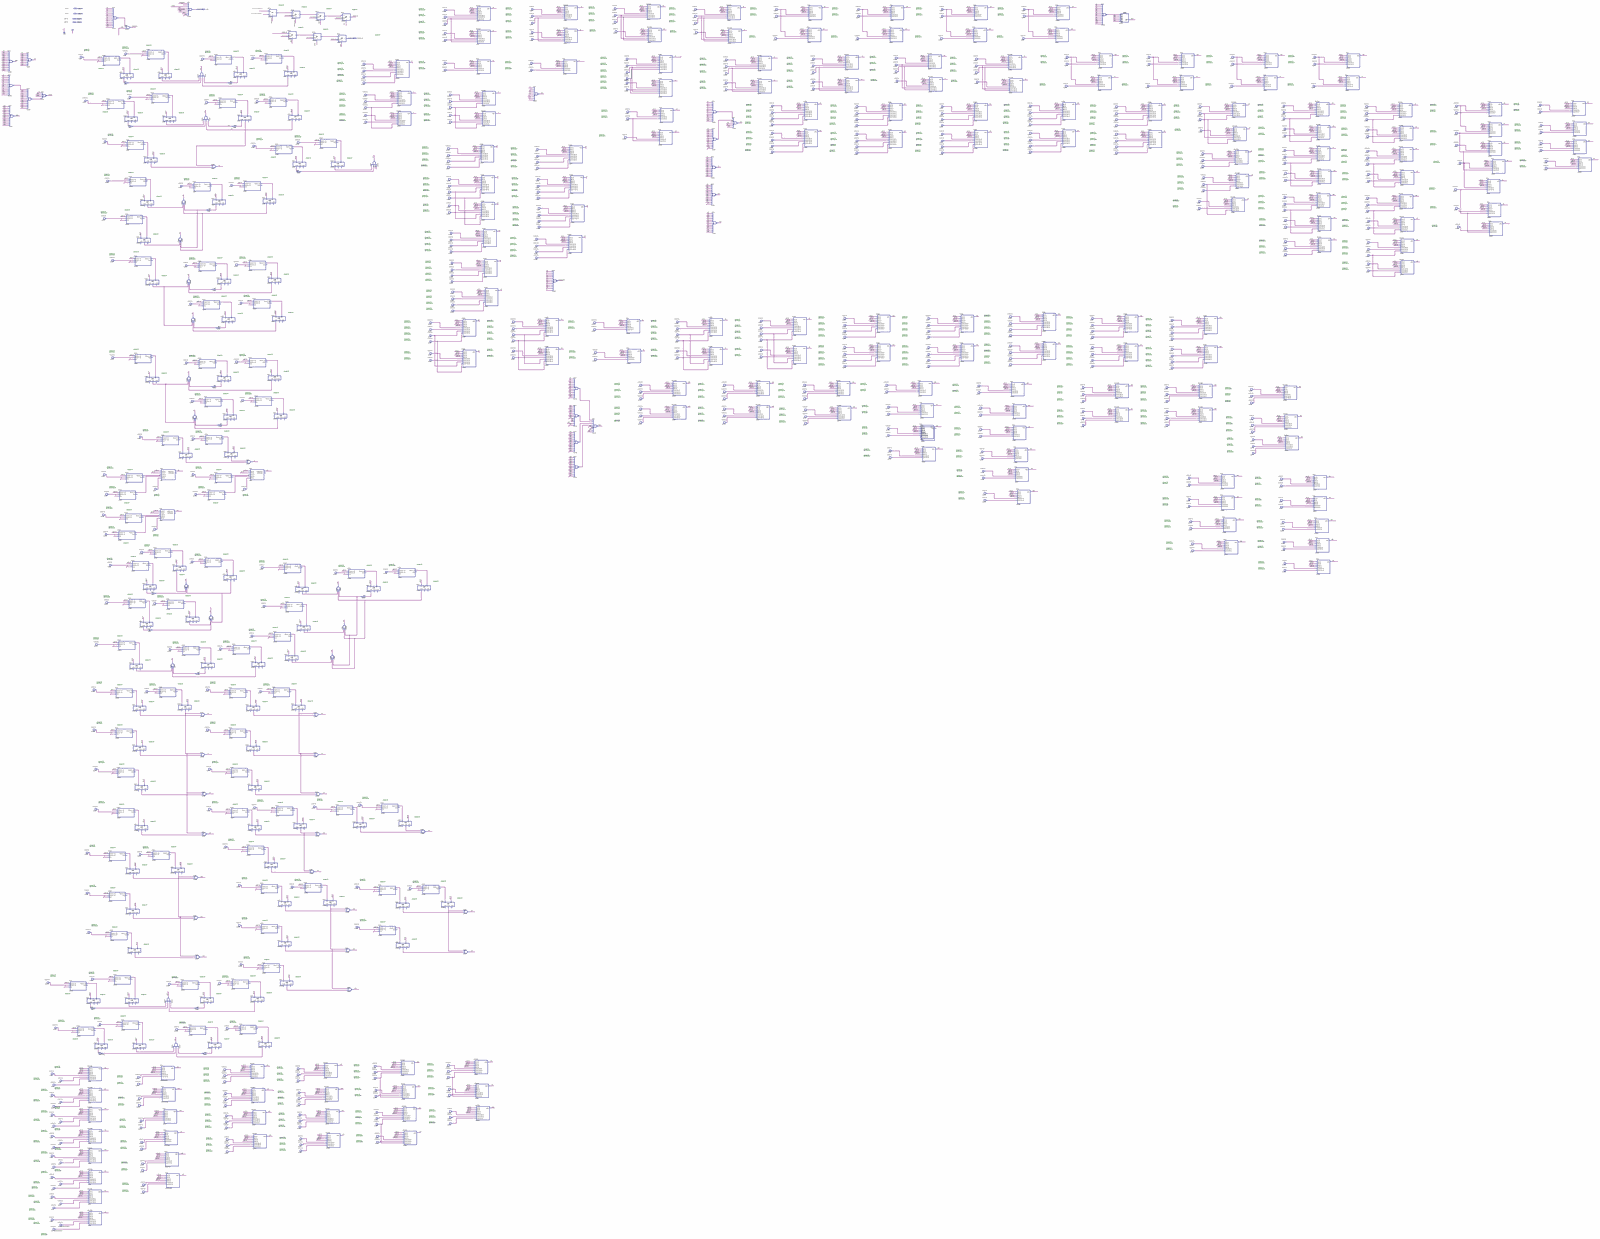
[diagram p0: schematic sheet, whole]
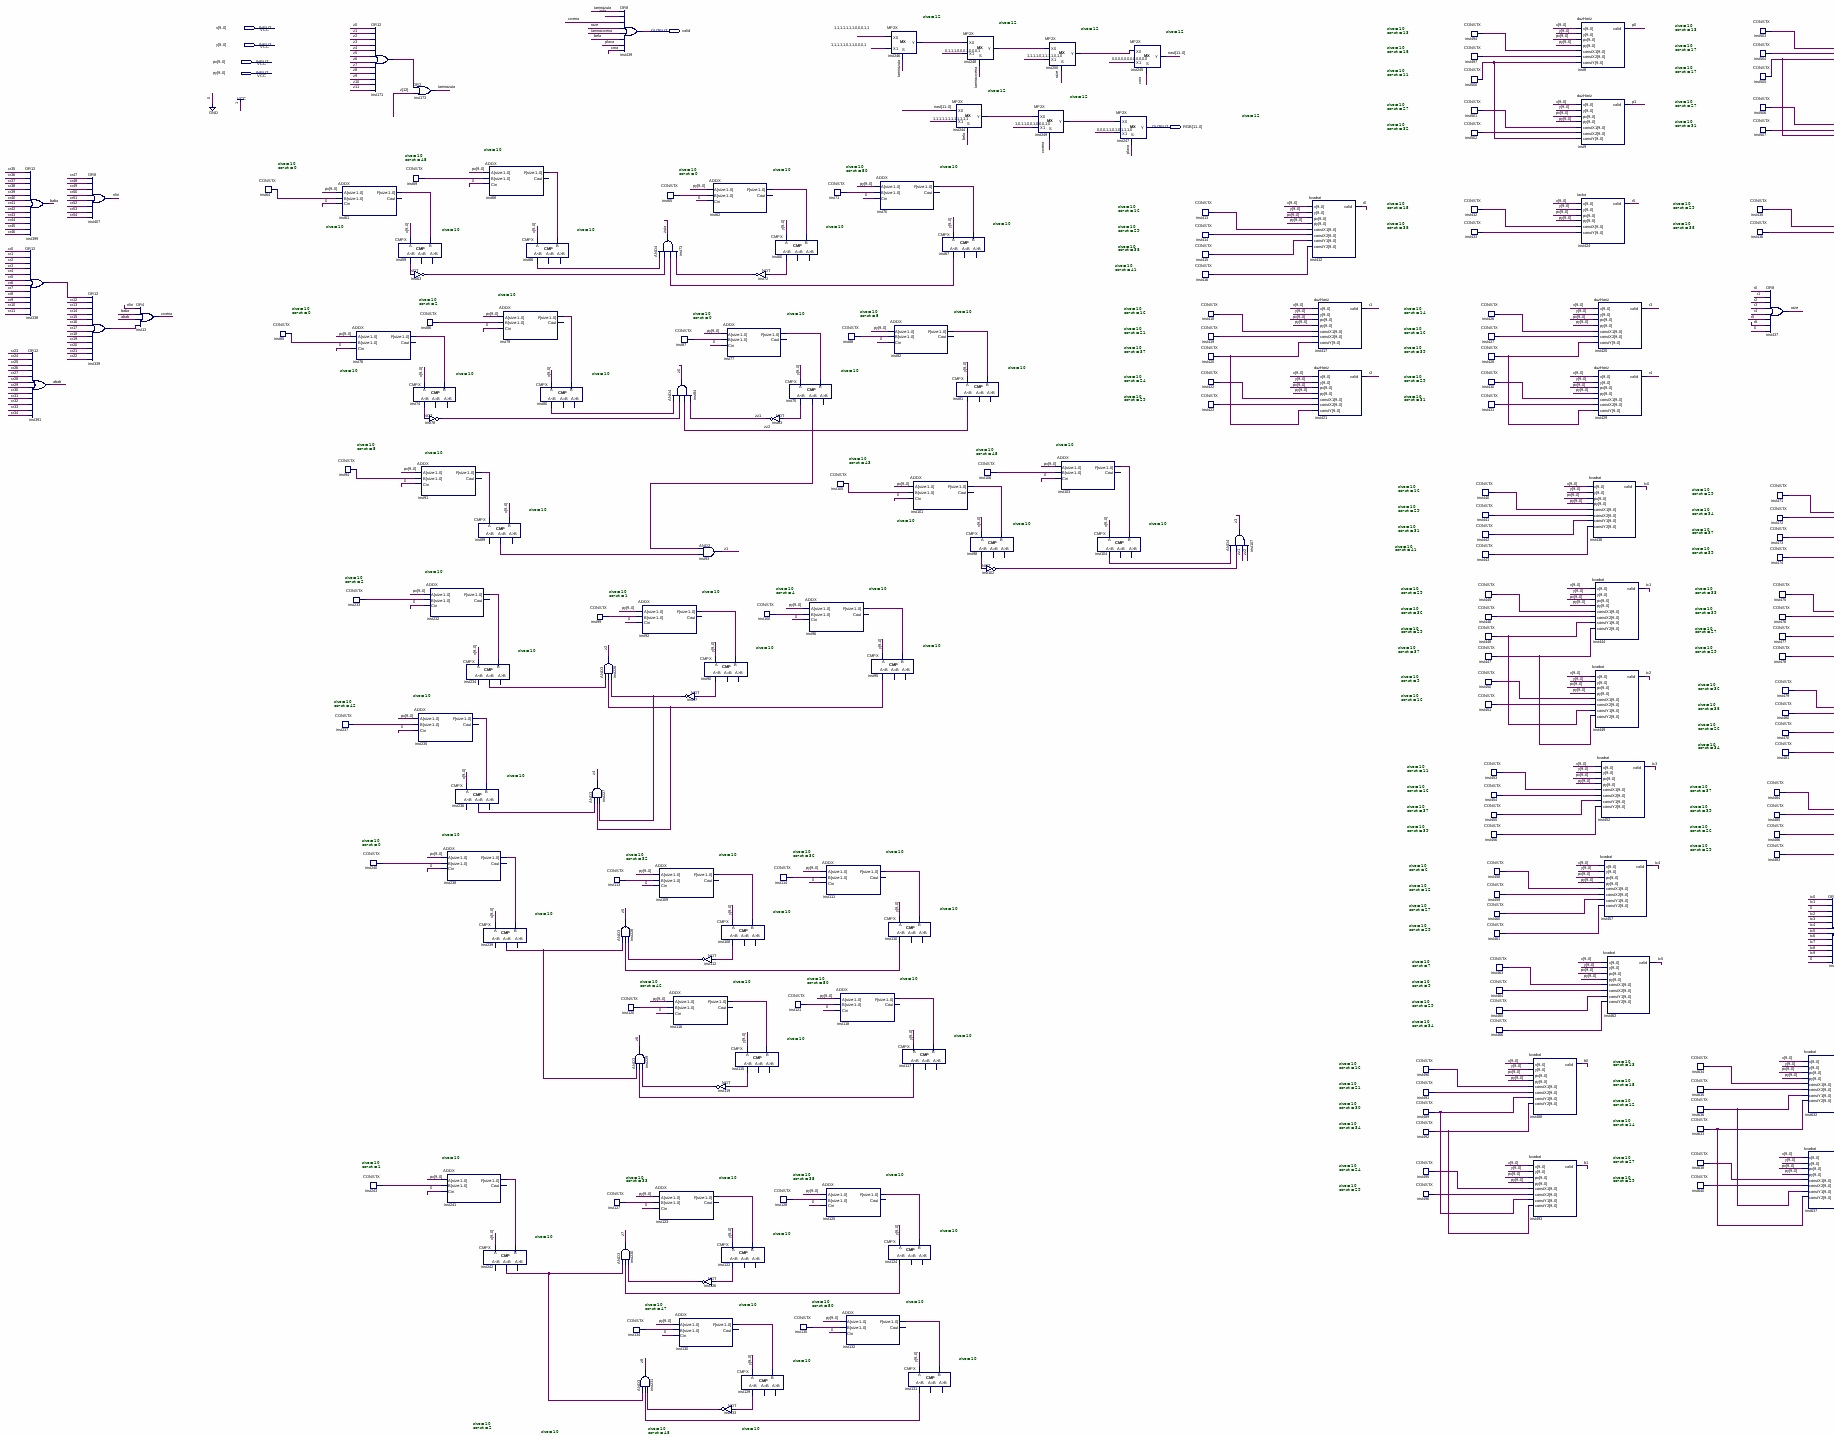
[diagram p1: schematic sheet, upper left part]
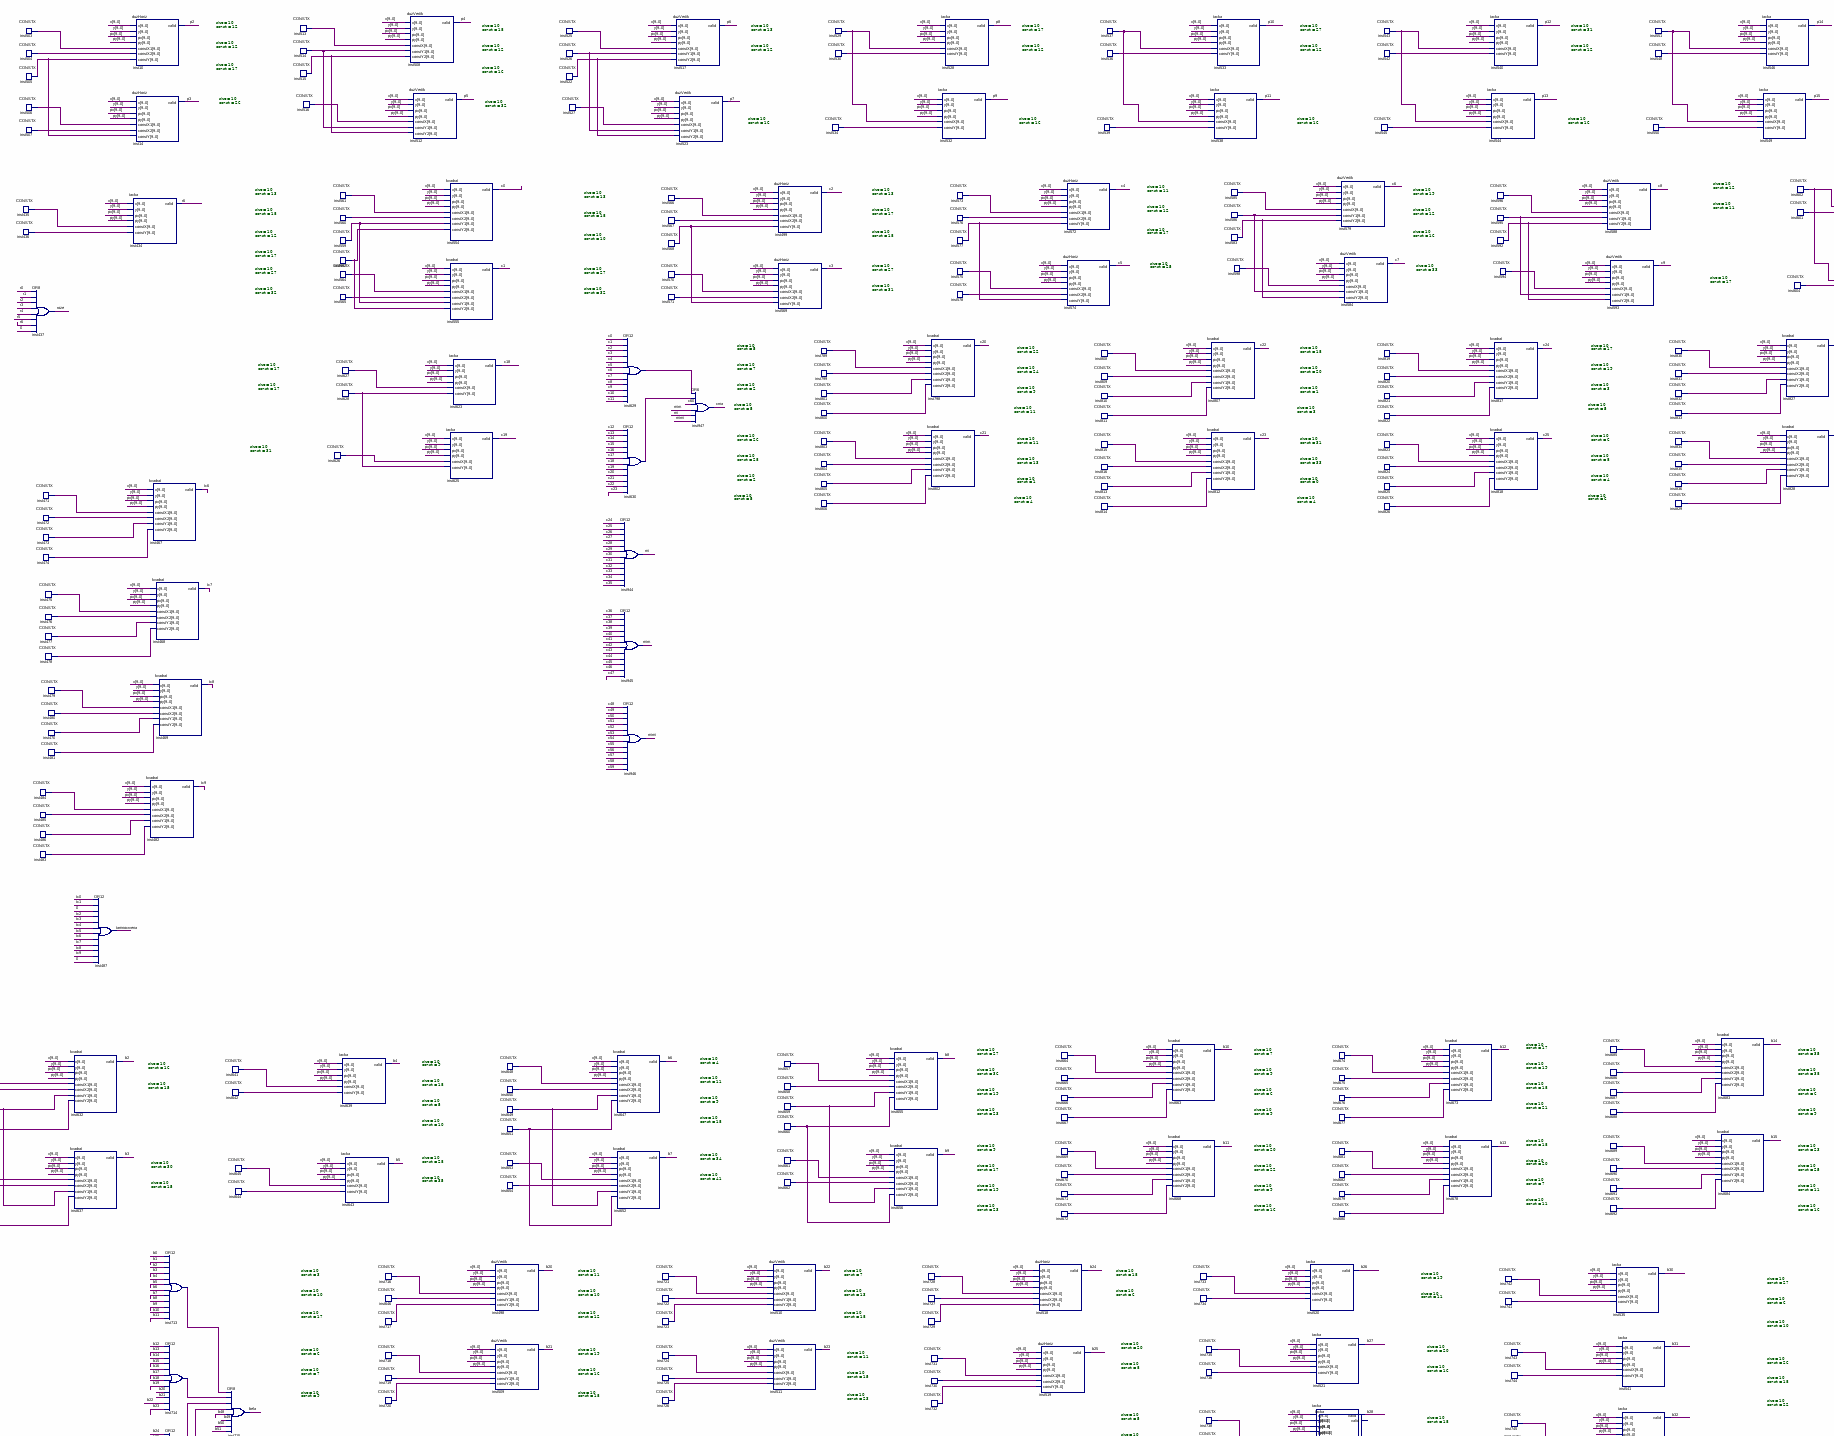
[diagram p2: schematic sheet, upper centre part]
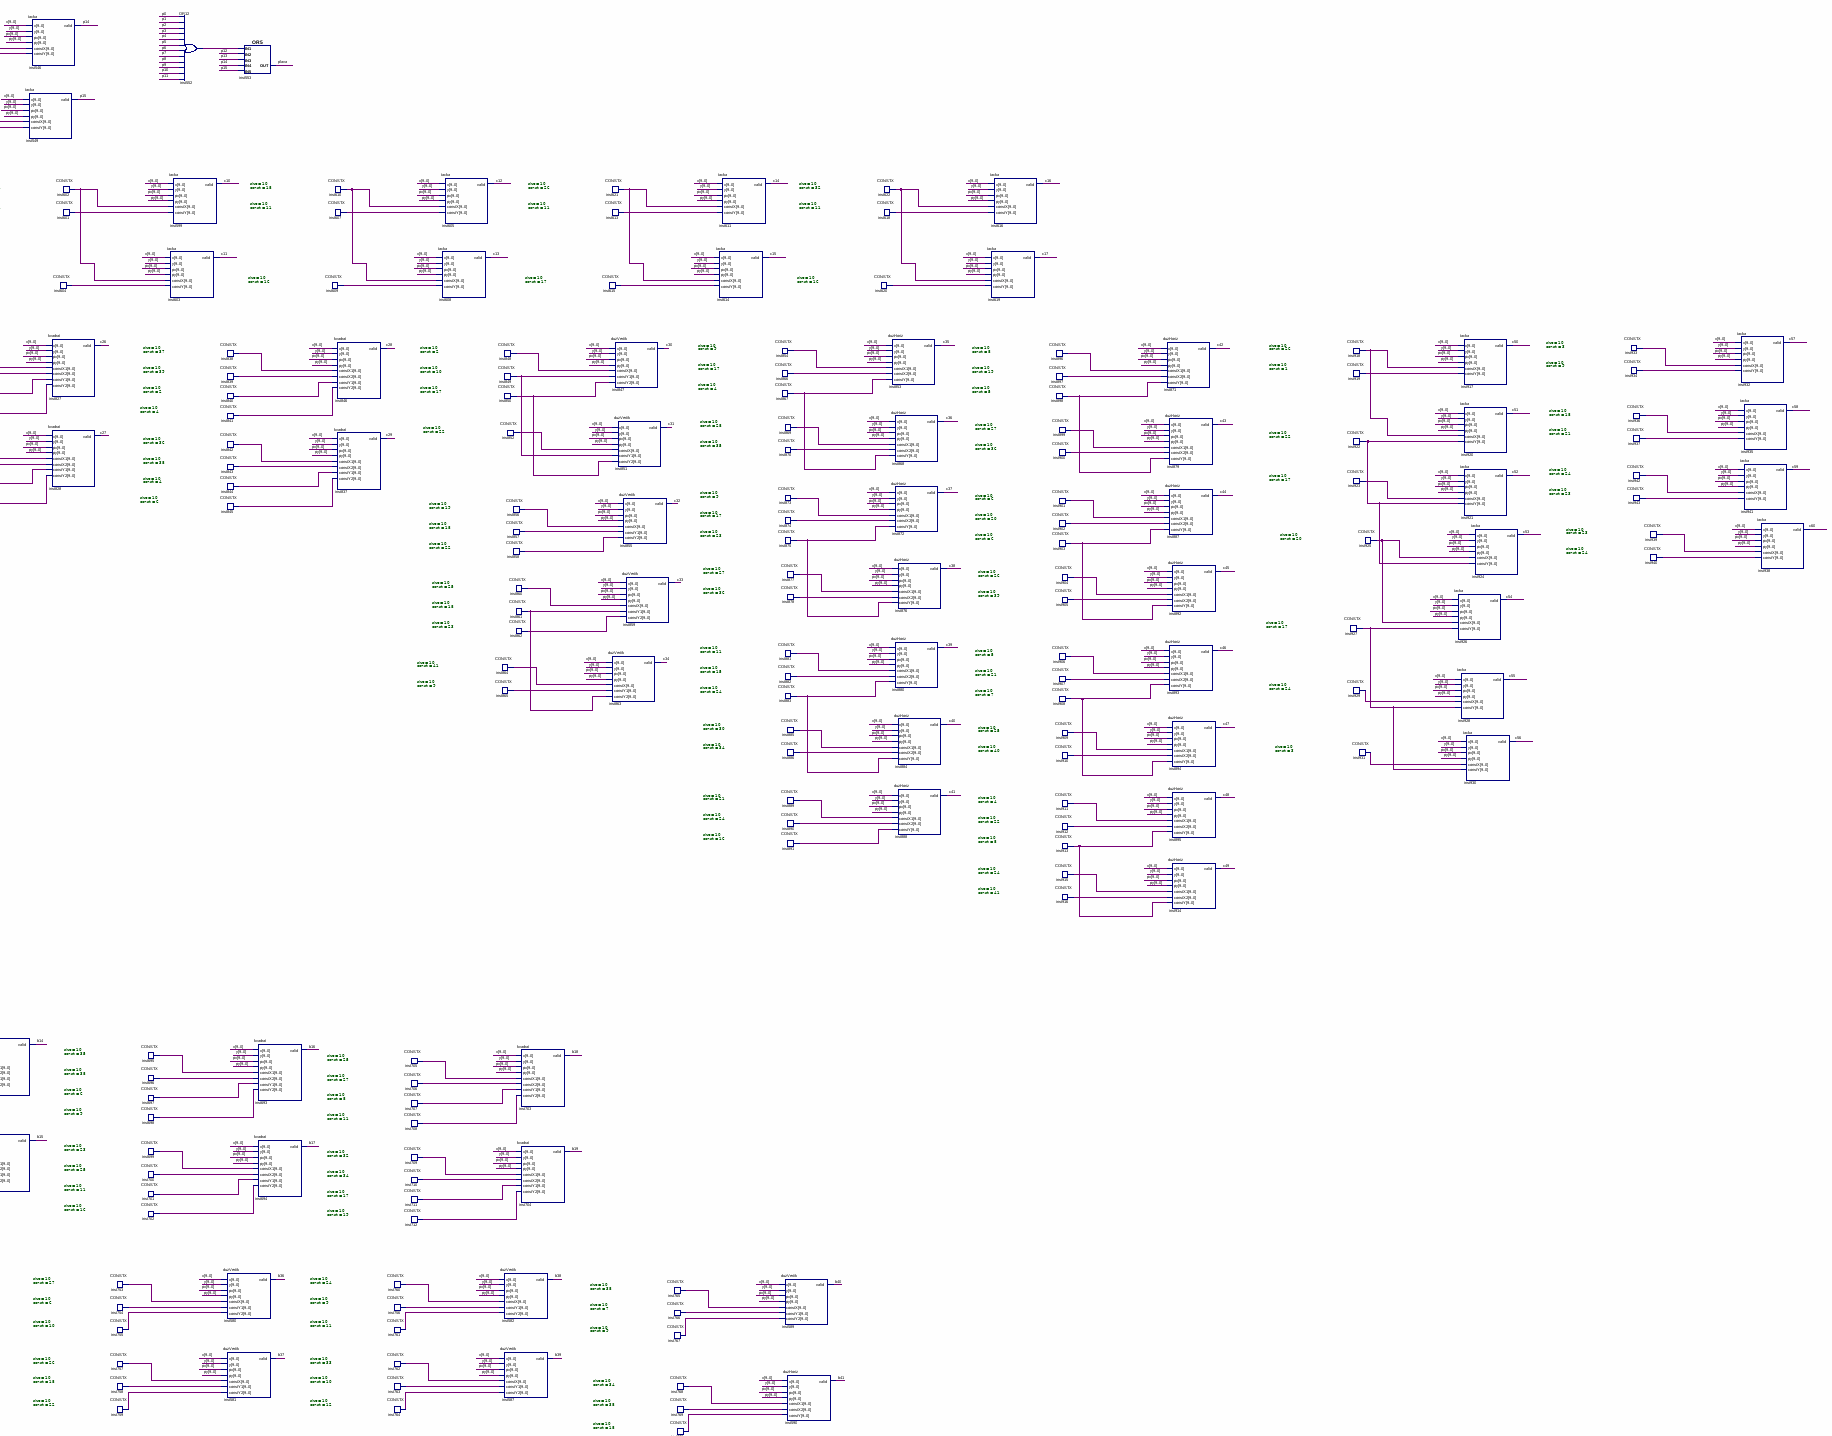
[diagram p3: schematic sheet, upper right part]
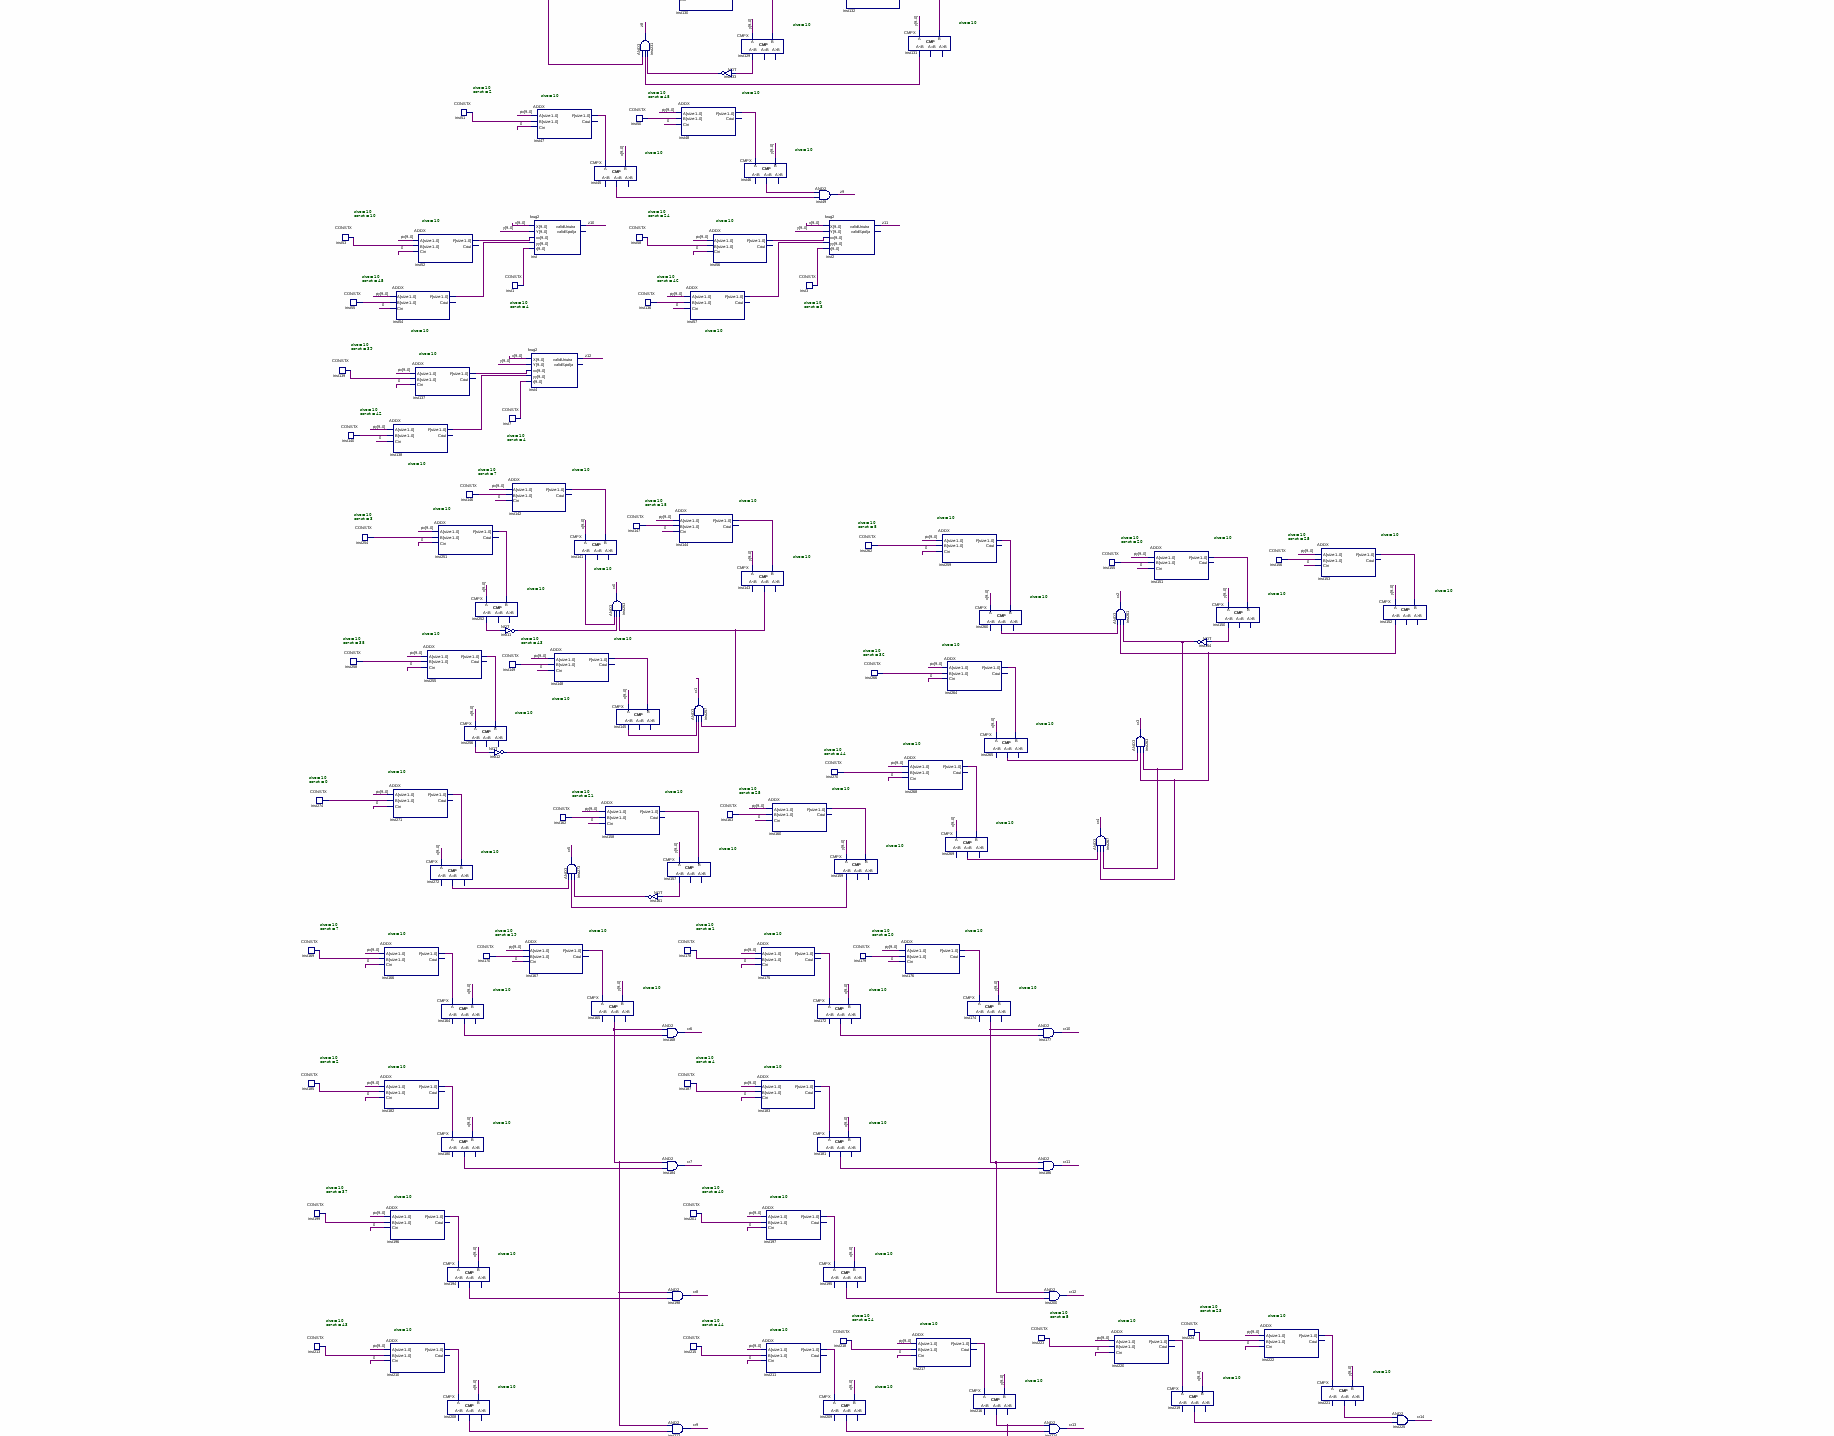
[diagram p4: schematic sheet, middle left part]
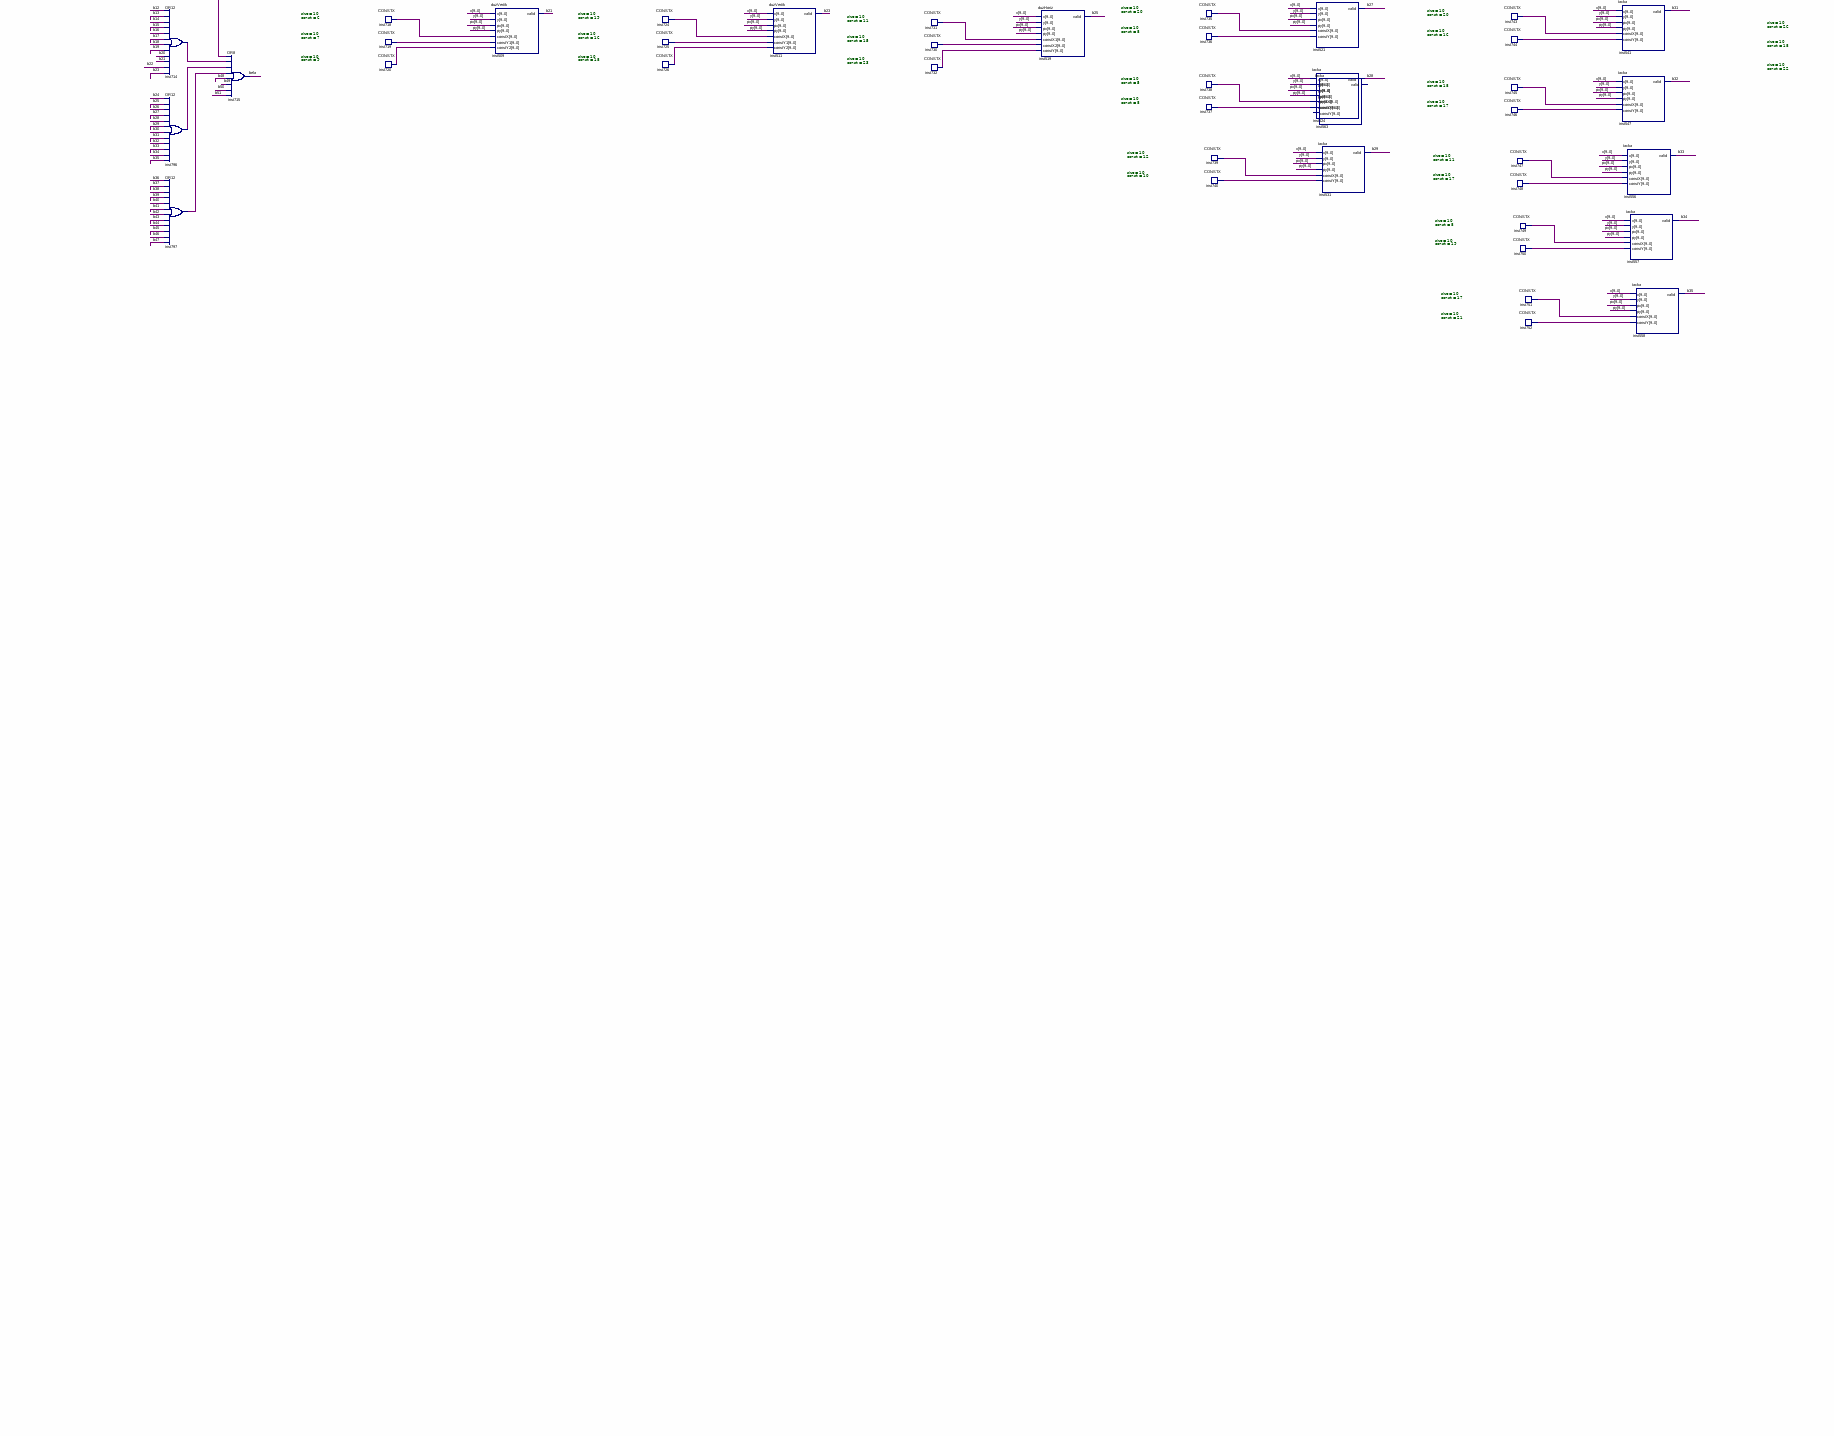
[diagram p5: schematic sheet, middle centre part]
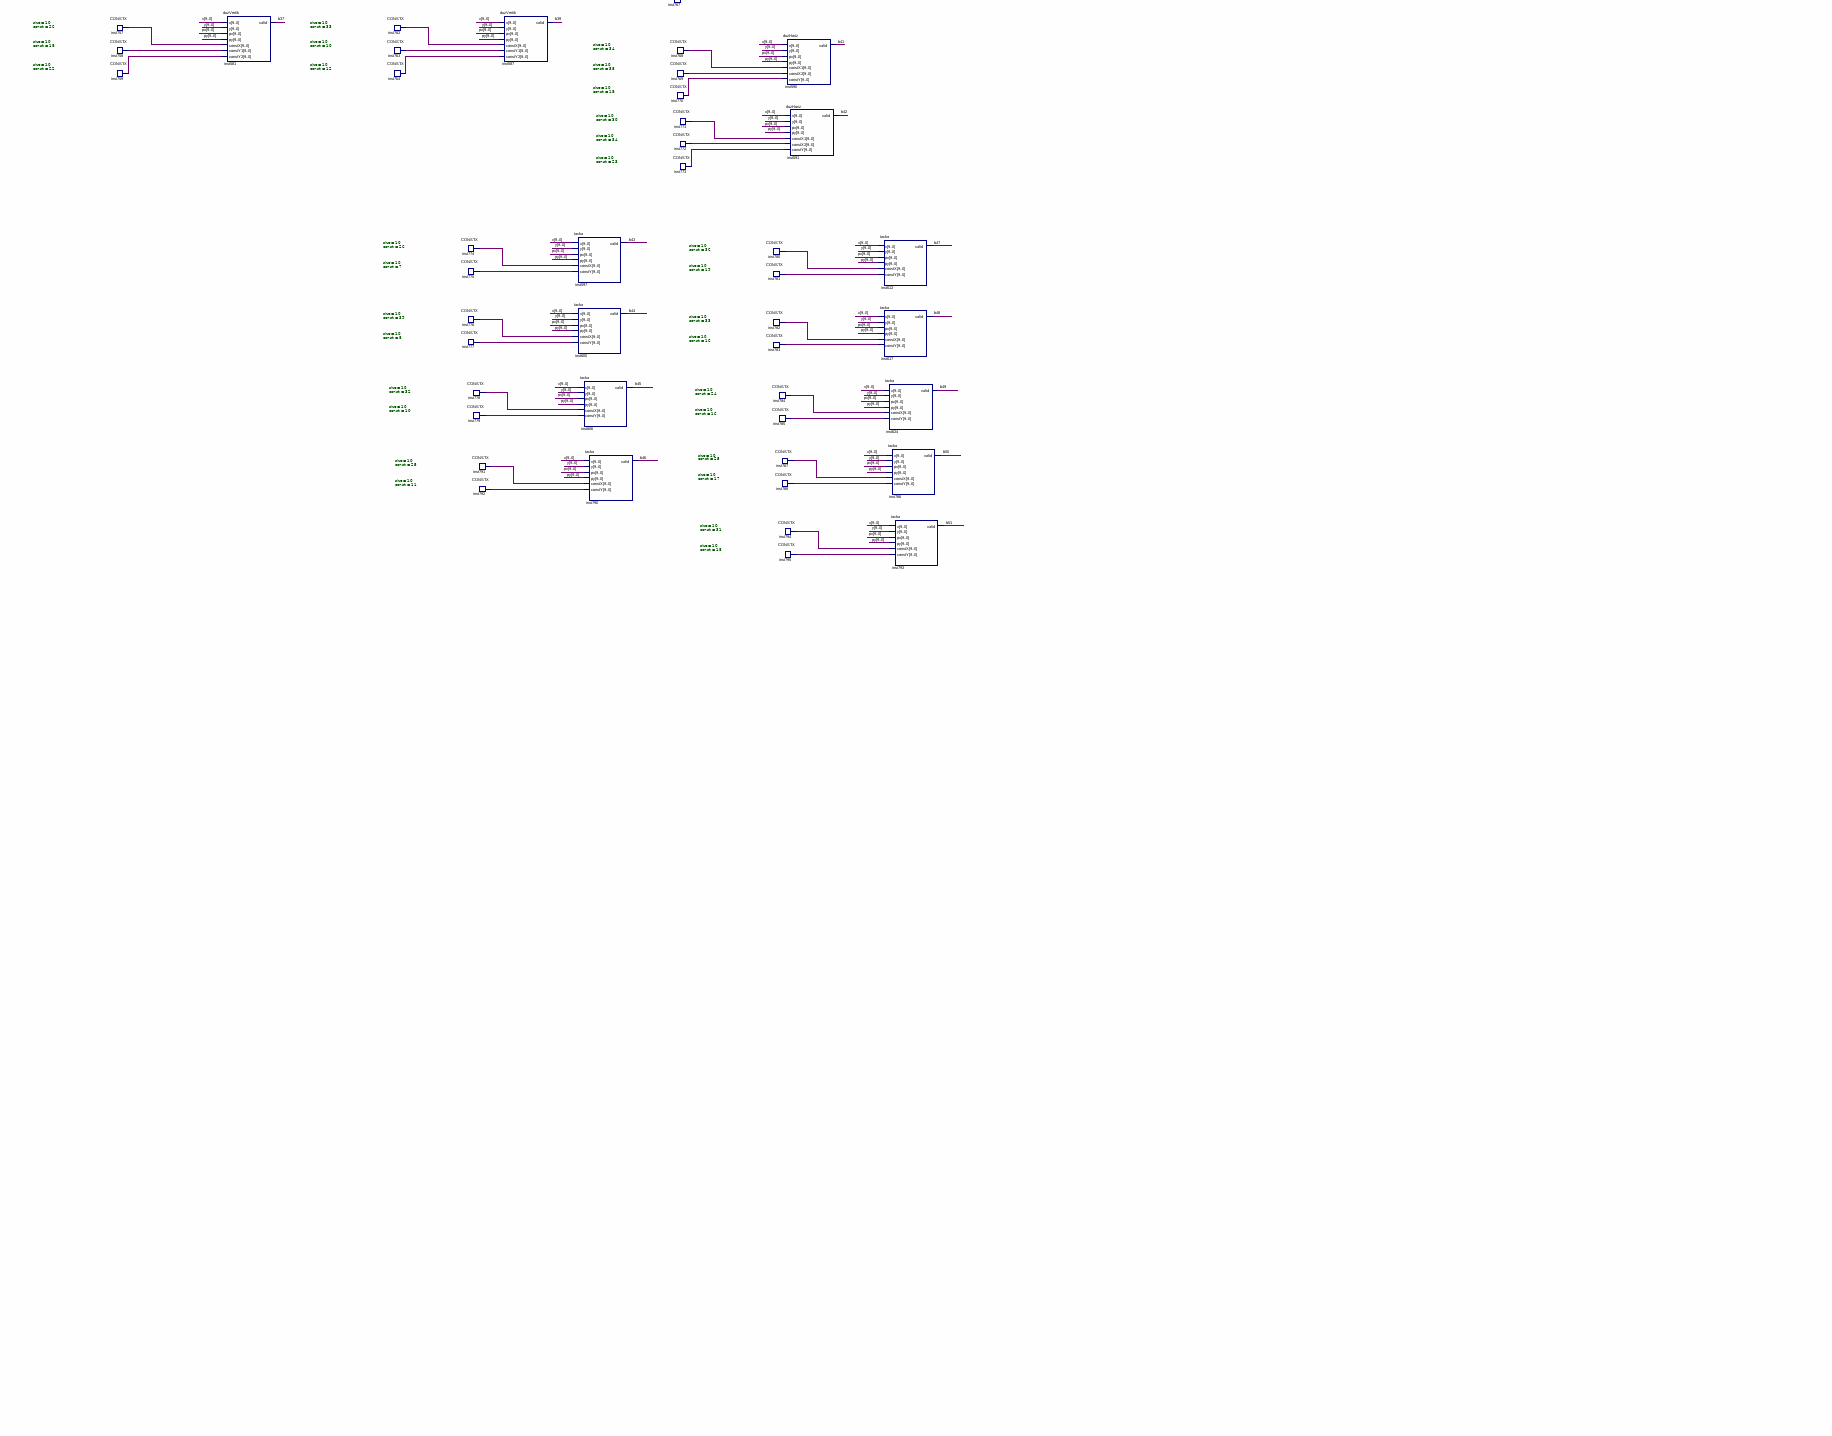
[diagram p6: schematic sheet, middle right part]
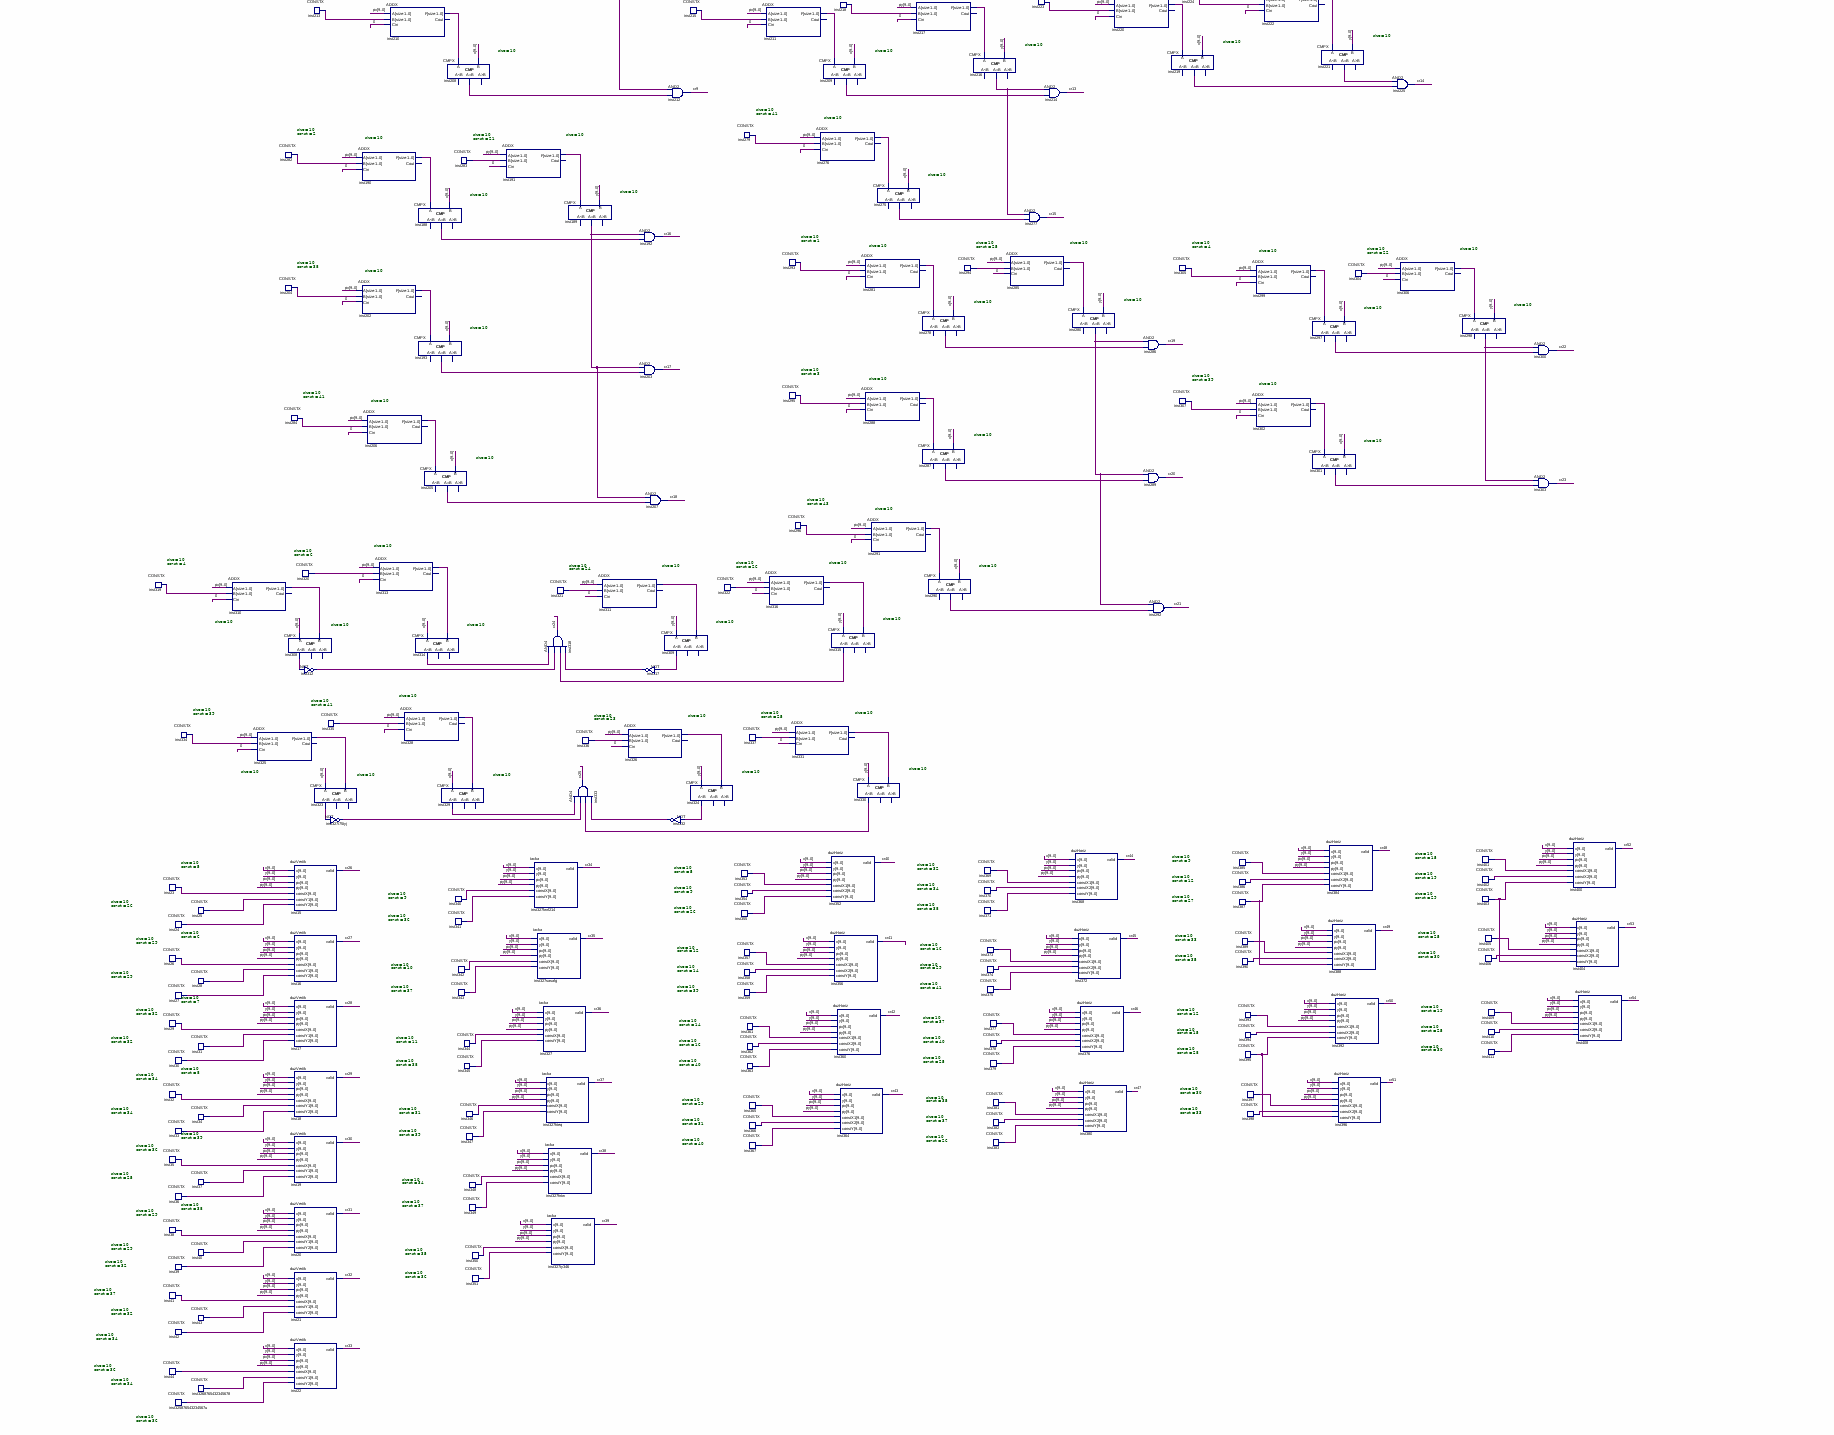
[diagram p7: schematic sheet, lower left part]
// Quartus schematic SundjerBob.bdf as structural Verilog: 953 symbols, 6 pins
module SundjerBob (
  input  [9:0] x,
  input  [9:0] y,
  input  [9:0] px,
  input  [9:0] py,
  output valid,
  output [11:0] RGB
);

  wire abab, b0, b1, b2, b3, b4, b5, b6, b7, b8, b9, b10, b11, b12, b13, b14, b15, b16, b17, b18, b19, b20,
       b21, b22, b23, b24, b25, b26, b27, b28, b29, b30, b31, b32, b33, b34, b35, b36, b37, b38, b39, b40,
       b41, b42, b43, b44, b45, b46, b47, b48, b49, b50, b51, baba, bela, c0, c1, c2, c3, c4, c5, c6, c7, c8,
       c9, c10, c11, c12, c13, c14, c15, c16, c17, c18, c19, c20, c21, c22, c23, c24, c25, c26, c27, c28,
       c29, c30, c31, c32, c33, c34, c35, c36, c37, c38, c39, c40, c41, c42, c43, c44, c45, c46, c47, c48,
       c49, c50, c51, c52, c53, c54, c55, c56, c57, c58, c59, c60, cr0, cr1, cr2, cr3, cr4, cr5, cr6, cr7,
       cr8, cr9, cr10, cr11, cr12, cr13, cr14, cr15, cr16, cr17, cr18, cr19, cr20, cr21, cr22, cr23, cr24,
       cr25, cr26, cr27, cr28, cr29, cr30, cr31, cr32, cr33, cr34, cr35, cr36, cr37, cr38, cr39, cr40, cr41,
       cr42, cr43, cr44, cr45, cr46, cr47, cr48, cr49, cr50, cr51, cr52, cr53, cr54, crna, crvena,
       inst11_out, inst12_out, inst45_eq, inst46_eq, inst59_ls, inst60_ls, inst63_out, inst66_ls, inst67_ls,
       inst72_out, inst74_ls, inst75_eq, inst75_ls, inst78_out, inst80_ls, inst89_eq, inst90_ls, inst95_ls,
       inst97_out, inst98_ls, inst102_out, inst104_ls, inst108_ls, inst110_ls, inst112_out, inst115_ls,
       inst117_ls, inst119_out, inst122_ls, inst124_ls, inst126_out, inst129_ls, inst131_ls, inst133_out,
       inst141_ls, inst143_eq, inst145_ls, inst150_ls, inst152_ls, inst154_out, inst157_ls, inst159_ls,
       inst161_out, inst164_eq, inst165_eq, inst171_out, inst172_eq, inst174_eq, inst180_eq, inst181_eq,
       inst188_eq, inst189_eq, inst193_eq, inst194_eq, inst195_eq, inst205_eq, inst208_eq, inst209_eq,
       inst216_eq, inst219_eq, inst221_eq, inst234_eq, inst236_eq, inst239_eq, inst242_eq, inst252_ls,
       inst256_ls, inst260_eq, inst265_eq, inst269_eq, inst272_eq, inst275_eq, inst278_eq, inst280_eq,
       inst287_eq, inst290_eq, inst297_eq, inst298_eq, inst301_eq, inst308_ls, inst309_ls, inst312_out,
       inst314_ls, inst315_ls, inst317_out, inst323_ls, inst324_ls, inst327i75tyj_out, inst329_ls,
       inst330_ls, inst332_out, inst338_out, inst339_out, inst552_out, inst629_out, inst630_out, inst713_out,
       inst714_out, inst796_out, inst797_out, mi, mim, mimi, nlin, p0, p1, p2, p3, p4, p5, p6, p7, p8, p9,
       p10, p11, p12, p13, p14, p15, plava, r0, r1, r2, r3, r4, r5, r6, roze, tamnocrvena, tamnozuta, tc0,
       tc1, tc2, tc3, tc4, tc5, tc6, tc7, tc8, tc9, z0, z1, z2, z3, z4, z5, z6, z7, z8, z9, z10, z11, zuta,
       zz1, zz2;
  wire [9:0] inst1_data, inst3_data, inst7_data, inst23_data, inst24_data, inst25_data, inst26_data,
       inst27_data, inst28_data, inst29_data, inst30_data, inst31_data, inst32_data, inst33_data,
       inst34_data, inst35_data, inst36_data, inst37_data, inst38_data, inst39_data, inst40_data,
       inst41_data, inst42_data, inst43_data, inst44_data, inst47_f, inst48_f, inst50_data, inst51_data,
       inst52_f, inst53_data, inst54_f, inst55_data, inst56_f, inst57_f, inst58_data, inst61_f, inst62_f,
       inst64_data, inst65_data, inst68_f, inst69_data, inst70_f, inst71_data, inst76_f, inst77_f, inst79_f,
       inst82_f, inst85_data, inst86_data, inst87_data, inst88_data, inst91_f, inst92_f, inst94_data,
       inst96_f, inst99_data, inst100_data, inst101_f, inst103_f, inst105_data, inst106_data, inst109_f,
       inst111_f, inst113_data, inst114_data, inst116_f, inst118_f, inst120_data, inst121_data, inst123_f,
       inst125_f, inst127_data, inst128_data, inst130_f, inst132_f, inst134_data, inst135_data, inst136_data,
       inst137_f, inst138_f, inst139_data, inst140_data, inst142_f, inst144_f, inst146_data, inst147_data,
       inst148_f, inst149_data, inst151_f, inst153_f, inst155_data, inst156_data, inst158_f, inst160_f,
       inst162_data, inst163_data, inst166_f, inst167_f, inst169_data, inst170_data, inst175_f, inst176_f,
       inst178_data, inst179_data, inst182_f, inst183_f, inst185_data, inst187_data, inst190_f, inst191_f,
       inst196_f, inst197_f, inst199_data, inst201_data, inst202_f, inst204_data, inst206_f, inst210_f,
       inst211_f, inst213_data, inst215_data, inst217_f, inst218_data, inst220_f, inst222_f, inst223_data,
       inst224_data, inst232_f, inst233_data, inst235_f, inst237_data, inst238_f, inst240_data, inst241_f,
       inst243_data, inst251_f, inst254_data, inst255_f, inst258_data, inst259_f, inst262_data, inst264_f,
       inst266_data, inst268_f, inst270_data, inst271_f, inst274_data, inst276_f, inst279_data, inst281_f,
       inst282_data, inst283_data, inst284_data, inst285_f, inst288_f, inst291_f, inst293_data, inst294_data,
       inst295_data, inst296_data, inst299_f, inst302_f, inst304_data, inst305_data, inst306_f, inst307_data,
       inst310_f, inst311_f, inst313_f, inst316_f, inst319_data, inst320_data, inst321_data, inst322_data,
       inst325_f, inst326_f, inst328_f, inst331_f, inst334_data, inst335_data, inst336_data, inst337_data,
       inst340_data, inst341_data, inst342_data, inst343_data, inst344_data, inst345_data, inst346_data,
       inst347_data, inst348_data, inst349_data, inst350_data, inst351_data, inst353_data, inst354_data,
       inst355_data, inst357_data, inst358_data, inst359_data, inst361_data, inst362_data, inst363_data,
       inst365_data, inst366_data, inst367_data, inst369_data, inst370_data, inst371_data, inst373_data,
       inst374_data, inst375_data, inst377_data, inst378_data, inst379_data, inst381_data, inst382_data,
       inst383_data, inst385_data, inst386_data, inst387_data, inst389_data, inst390_data, inst393_data,
       inst394_data, inst395_data, inst397_data, inst398_data, inst401_data, inst402_data, inst403_data,
       inst405_data, inst406_data, inst409_data, inst410_data, inst411_data, inst413_data, inst414_data,
       inst415_data, inst416_data, inst418_data, inst419_data, inst420_data, inst422_data, inst423_data,
       inst426_data, inst427_data, inst428_data, inst430_data, inst431_data, inst432_data, inst433_data,
       inst435_data, inst436_data, inst440_data, inst441_data, inst442_data, inst443_data, inst445_data,
       inst446_data, inst447_data, inst448_data, inst450_data, inst451_data, inst453_data, inst454_data,
       inst455_data, inst456_data, inst458_data, inst459_data, inst460_data, inst461_data, inst463_data,
       inst464_data, inst465_data, inst466_data, inst470_data, inst471_data, inst472_data, inst473_data,
       inst474_data, inst475_data, inst476_data, inst477_data, inst478_data, inst479_data, inst480_data,
       inst481_data, inst483_data, inst484_data, inst485_data, inst486_data, inst489_data, inst490_data,
       inst491_data, inst492_data, inst494_data, inst495_data, inst496_data, inst497_data, inst500_data,
       inst501_data, inst502_data, inst503_data, inst504_data, inst505_data, inst506_data, inst507_data,
       inst513_data, inst514_data, inst515_data, inst516_data, inst522_data, inst525_data, inst526_data,
       inst527_data, inst529_data, inst530_data, inst534_data, inst536_data, inst537_data, inst539_data,
       inst542_data, inst543_data, inst545_data, inst548_data, inst550_data, inst551_data, inst559_data,
       inst560_data, inst561_data, inst562_data, inst564_data, inst565_data, inst566_data, inst567_data,
       inst568_data, inst570_data, inst571_data, inst573_data, inst575_data, inst576_data, inst577_data,
       inst578_data, inst583_data, inst585_data, inst586_data, inst592_data, inst594_data, inst595_data,
       inst596_data, inst598_data, inst601_data, inst602_data, inst604_data, inst607_data, inst609_data,
       inst610_data, inst613_data, inst615_data, inst618_data, inst620_data, inst621_data, inst622_data,
       inst626_data, inst627_data, inst628_data, inst633_data, inst634_data, inst635_data, inst636_data,
       inst638_data, inst640_data, inst641_data, inst642_data, inst644_data, inst645_data, inst646_data,
       inst648_data, inst649_data, inst650_data, inst651_data, inst653_data, inst654_data, inst657_data,
       inst658_data, inst659_data, inst660_data, inst661_data, inst662_data, inst664_data, inst665_data,
       inst666_data, inst667_data, inst669_data, inst670_data, inst671_data, inst672_data, inst674_data,
       inst675_data, inst676_data, inst677_data, inst679_data, inst680_data, inst681_data, inst682_data,
       inst685_data, inst686_data, inst687_data, inst688_data, inst689_data, inst690_data, inst691_data,
       inst692_data, inst695_data, inst696_data, inst697_data, inst698_data, inst699_data, inst700_data,
       inst701_data, inst702_data, inst705_data, inst706_data, inst707_data, inst708_data, inst709_data,
       inst710_data, inst711_data, inst712_data, inst716_data, inst717_data, inst718_data, inst719_data,
       inst720_data, inst721_data, inst722_data, inst723_data, inst724_data, inst725_data, inst726_data,
       inst727_data, inst728_data, inst729_data, inst730_data, inst731_data, inst732_data, inst733_data,
       inst734_data, inst735_data, inst736_data, inst737_data, inst738_data, inst739_data, inst740_data,
       inst741_data, inst742_data, inst743_data, inst744_data, inst745_data, inst746_data, inst747_data,
       inst748_data, inst749_data, inst750_data, inst751_data, inst752_data, inst753_data, inst754_data,
       inst755_data, inst756_data, inst757_data, inst758_data, inst759_data, inst760_data, inst761_data,
       inst762_data, inst763_data, inst764_data, inst765_data, inst766_data, inst767_data, inst768_data,
       inst769_data, inst770_data, inst771_data, inst772_data, inst773_data, inst774_data, inst775_data,
       inst776_data, inst777_data, inst778_data, inst779_data, inst780_data, inst781_data, inst782_data,
       inst783_data, inst784_data, inst785_data, inst787_data, inst788_data, inst789_data, inst791_data,
       inst792_data, inst794_data, inst795_data, inst799_data, inst800_data, inst801_data, inst803_data,
       inst804_data, inst805_data, inst806_data, inst808_data, inst809_data, inst810_data, inst811_data,
       inst813_data, inst814_data, inst815_data, inst816_data, inst819_data, inst820_data, inst821_data,
       inst822_data, inst823_data, inst824_data, inst825_data, inst826_data, inst829_data, inst830_data,
       inst831_data, inst832_data, inst833_data, inst834_data, inst835_data, inst836_data, inst838_data,
       inst839_data, inst840_data, inst841_data, inst842_data, inst843_data, inst844_data, inst845_data,
       inst848_data, inst849_data, inst850_data, inst852_data, inst854_data, inst856_data, inst857_data,
       inst858_data, inst860_data, inst861_data, inst862_data, inst864_data, inst865_data, inst866_data,
       inst867_data, inst869_data, inst870_data, inst873_data, inst874_data, inst875_data, inst877_data,
       inst878_data, inst881_data, inst882_data, inst883_data, inst885_data, inst886_data, inst889_data,
       inst890_data, inst891_data, inst896_data, inst897_data, inst898_data, inst899_data, inst900_data,
       inst901_data, inst902_data, inst903_data, inst904_data, inst905_data, inst906_data, inst907_data,
       inst908_data, inst909_data, inst910_data, inst911_data, inst912_data, inst913_data, inst915_data,
       inst916_data, inst918_data, inst919_data, inst922_data, inst923_data, inst925_data, inst927_data,
       inst929_data, inst931_data, inst933_data, inst934_data, inst936_data, inst937_data, inst939_data,
       inst940_data, inst942_data, inst943_data, inst325876543234567u_data, inst3268765432345678_data;
  wire [11:0] inst244_y, inst246_y, inst248_y, inst249_y, inst250_y, nast;
  wire [12:12] z;

  or inst399 (baba, cr35, cr36, cr37, cr38, cr39, cr40, cr41, cr42, cr43, cr44, cr45, cr46);
  or inst338 (inst338_out, cr0, cr1, cr2, cr3, cr4, cr5, cr6, cr7, cr8, cr9, cr10, cr11);
  or inst391 (abab, cr23, cr24, cr25, cr26, cr27, cr28, cr29, cr30, cr31, cr32, cr33, cr34);
  or inst407 (nlin, cr47, cr48, cr49, cr50, cr51, cr52, cr53, cr54);
  or inst339 (inst339_out, inst338_out, cr12, cr13, cr14, cr15, cr16, cr17, cr18, cr19, cr20, cr21, cr22);
  or inst13 (crvena, nlin, baba, abab, inst339_out);
  CONSTX #(.size(10), .\const (4)) inst319 (.data(inst319_data));
  CONSTX #(.size(10), .\const (5)) inst23 (.data(inst23_data));
  CONSTX #(.size(10), .\const (29)) inst24 (.data(inst24_data));
  CONSTX #(.size(10), .\const (6)) inst26 (.data(inst26_data));
  CONSTX #(.size(10), .\const (32)) inst27 (.data(inst27_data));
  CONSTX #(.size(10), .\const (7)) inst29 (.data(inst29_data));
  CONSTX #(.size(10), .\const (34)) inst30 (.data(inst30_data));
  CONSTX #(.size(10), .\const (8)) inst32 (.data(inst32_data));
  CONSTX #(.size(10), .\const (36)) inst33 (.data(inst33_data));
  CONSTX #(.size(10), .\const (39)) inst35 (.data(inst35_data));
  CONSTX #(.size(10), .\const (29)) inst36 (.data(inst36_data));
  CONSTX #(.size(10), .\const (38)) inst38 (.data(inst38_data));
  CONSTX #(.size(10), .\const (32)) inst39 (.data(inst39_data));
  CONSTX #(.size(10), .\const (37)) inst41 (.data(inst41_data));
  CONSTX #(.size(10), .\const (34)) inst42 (.data(inst42_data));
  CONSTX #(.size(10), .\const (36)) inst44 (.data(inst44_data));
  CONSTX #(.size(10), .\const (36)) inst325876543234567u (.data(inst325876543234567u_data));
  CONSTX #(.size(10), .\const (39)) inst334 (.data(inst334_data));
  CONSTX #(.size(10), .\const (26)) inst25 (.data(inst25_data));
  CONSTX #(.size(10), .\const (29)) inst28 (.data(inst28_data));
  CONSTX #(.size(10), .\const (32)) inst31 (.data(inst31_data));
  CONSTX #(.size(10), .\const (34)) inst34 (.data(inst34_data));
  CONSTX #(.size(10), .\const (25)) inst37 (.data(inst37_data));
  CONSTX #(.size(10), .\const (29)) inst40 (.data(inst40_data));
  CONSTX #(.size(10), .\const (32)) inst43 (.data(inst43_data));
  CONSTX #(.size(10), .\const (34)) inst3268765432345678 (.data(inst3268765432345678_data));
  ADDX #(.size(10)) inst310 (.A(px), .B(inst319_data), .Cin(1'b0), .F(inst310_f));  // open: Cout
  CONSTX #(.size(10), .\const (0)) inst64 (.data(inst64_data));
  ADDX #(.size(10)) inst325 (.A(px), .B(inst334_data), .Cin(1'b0), .F(inst325_f));  // open: Cout
  CONSTX #(.size(10), .\const (0)) inst85 (.data(inst85_data));
  CONSTX #(.size(10), .\const (2)) inst282 (.data(inst282_data));
  CONSTX #(.size(10), .\const (38)) inst204 (.data(inst204_data));
  CONSTX #(.size(10), .\const (7)) inst169 (.data(inst169_data));
  CONSTX #(.size(10), .\const (2)) inst185 (.data(inst185_data));
  CONSTX #(.size(10), .\const (41)) inst284 (.data(inst284_data));
  CONSTX #(.size(10), .\const (6)) inst320 (.data(inst320_data));
  CMPX #(.size(10)) inst308 (.A(x), .B(inst310_f), .ls(inst308_ls));  // open: eq, gr
  not inst312 (inst312_out, inst308_ls);
  duzVertik inst15 (
    .x(x), .y(y), .px(px), .py(py), .constX(inst23_data), .constY1(inst25_data), .constY2(inst24_data),
    .valid(cr26));
  duzVertik inst16 (
    .x(x), .y(y), .px(px), .py(py), .constX(inst26_data), .constY1(inst28_data), .constY2(inst27_data),
    .valid(cr27));
  duzVertik inst17 (
    .x(x), .y(y), .px(px), .py(py), .constX(inst29_data), .constY1(inst31_data), .constY2(inst30_data),
    .valid(cr28));
  duzVertik inst18 (
    .x(x), .y(y), .px(px), .py(py), .constX(inst32_data), .constY1(inst34_data), .constY2(inst33_data),
    .valid(cr29));
  duzVertik inst19 (
    .x(x), .y(y), .px(px), .py(py), .constX(inst35_data), .constY1(inst37_data), .constY2(inst36_data),
    .valid(cr30));
  duzVertik inst20 (
    .x(x), .y(y), .px(px), .py(py), .constX(inst38_data), .constY1(inst40_data), .constY2(inst39_data),
    .valid(cr31));
  duzVertik inst21 (
    .x(x), .y(y), .px(px), .py(py), .constX(inst41_data), .constY1(inst43_data), .constY2(inst42_data),
    .valid(cr32));
  duzVertik inst22 (
    .x(x), .y(y), .px(px), .py(py), .constX(inst44_data), .constY1(inst3268765432345678_data),
    .constY2(inst325876543234567u_data), .valid(cr33));
  CONSTX #(.size(10), .\const (0)) inst274 (.data(inst274_data));
  CONSTX #(.size(10), .\const (37)) inst199 (.data(inst199_data));
  CONSTX #(.size(10), .\const (43)) inst213 (.data(inst213_data));
  CONSTX #(.size(10), .\const (41)) inst335 (.data(inst335_data));
  CMPX #(.size(10)) inst323 (.A(x), .B(inst325_f), .ls(inst323_ls));  // open: eq, gr
  not inst327i75tyj (inst327i75tyj_out, inst323_ls);
  ADDX #(.size(10)) inst61 (.A(px), .B(inst64_data), .Cin(1'b0), .F(inst61_f));  // open: Cout
  CONSTX #(.size(10), .\const (5)) inst94 (.data(inst94_data));
  CONSTX #(.size(10), .\const (2)) inst233 (.data(inst233_data));
  CONSTX #(.size(10), .\const (42)) inst237 (.data(inst237_data));
  CONSTX #(.size(10), .\const (10)) inst53 (.data(inst53_data));
  CONSTX #(.size(10), .\const (45)) inst55 (.data(inst55_data));
  CONSTX #(.size(10), .\const (39)) inst139 (.data(inst139_data));
  CONSTX #(.size(10), .\const (42)) inst140 (.data(inst140_data));
  CONSTX #(.size(10), .\const (38)) inst258 (.data(inst258_data));
  or inst171 (inst171_out, z0, z1, z2, z3, z4, z5, z6, z7, z8, z9, z10, z11);
  ADDX #(.size(10)) inst76 (.A(px), .B(inst85_data), .Cin(1'b0), .F(inst76_f));  // open: Cout
  CONSTX #(.size(10), .\const (0)) inst240 (.data(inst240_data));
  CONSTX #(.size(10), .\const (1)) inst243 (.data(inst243_data));
  CONSTX #(.size(10), .\const (3)) inst254 (.data(inst254_data));
  ADDX #(.size(10)) inst190 (.A(px), .B(inst282_data), .Cin(1'b0), .F(inst190_f));  // open: Cout
  ADDX #(.size(10)) inst202 (.A(px), .B(inst204_data), .Cin(1'b0), .F(inst202_f));  // open: Cout
  ADDX #(.size(10)) inst206 (.A(px), .B(inst284_data), .Cin(1'b0), .F(inst206_f));  // open: Cout
  CMPX #(.size(10)) inst59 (.A(x), .B(inst61_f), .ls(inst59_ls));  // open: eq, gr
  ADDX #(.size(10)) inst54 (.A(py), .B(inst55_data), .Cin(1'b0), .F(inst54_f));  // open: Cout
  ADDX #(.size(10)) inst138 (.A(py), .B(inst140_data), .Cin(1'b0), .F(inst138_f));  // open: Cout
  ADDX #(.size(10)) inst271 (.A(px), .B(inst274_data), .Cin(1'b0), .F(inst271_f));  // open: Cout
  ADDX #(.size(10)) inst166 (.A(px), .B(inst169_data), .Cin(1'b0), .F(inst166_f));  // open: Cout
  ADDX #(.size(10)) inst182 (.A(px), .B(inst185_data), .Cin(1'b0), .F(inst182_f));  // open: Cout
  ADDX #(.size(10)) inst196 (.A(px), .B(inst199_data), .Cin(1'b0), .F(inst196_f));  // open: Cout
  ADDX #(.size(10)) inst210 (.A(px), .B(inst213_data), .Cin(1'b0), .F(inst210_f));  // open: Cout
  ADDX #(.size(10)) inst313 (.A(px), .B(inst320_data), .Cin(1'b0), .F(inst313_f));  // open: Cout
  or inst173 (tamnozuta, inst171_out, z[12]);
  CONSTX #(.size(10), .\const (45)) inst69 (.data(inst69_data));
  not inst63 (inst63_out, inst59_ls);
  CMPX #(.size(10)) inst74 (.A(x), .B(inst76_f), .ls(inst74_ls));  // open: eq, gr
  ADDX #(.size(10)) inst91 (.A(px), .B(inst94_data), .Cin(1'b0), .F(inst91_f));  // open: Cout
  ADDX #(.size(10)) inst235 (.A(px), .B(inst237_data), .Cin(1'b0), .F(inst235_f));  // open: Cout
  ADDX #(.size(10)) inst52 (.A(px), .B(inst53_data), .Cin(1'b0), .F(inst52_f));  // open: Cout
  ADDX #(.size(10)) inst137 (.A(px), .B(inst139_data), .Cin(1'b0), .F(inst137_f));  // open: Cout
  CMPX #(.size(10)) inst188 (.A(inst190_f), .B(x), .eq(inst188_eq));  // open: ls, gr
  CMPX #(.size(10)) inst193 (.A(inst202_f), .B(x), .eq(inst193_eq));  // open: ls, gr
  CMPX #(.size(10)) inst314 (.A(x), .B(inst313_f), .ls(inst314_ls));  // open: eq, gr
  ADDX #(.size(10)) inst328 (.A(px), .B(inst335_data), .Cin(1'b0), .F(inst328_f));  // open: Cout
  CONSTX #(.size(10), .\const (2)) inst86 (.data(inst86_data));
  not inst78 (inst78_out, inst74_ls);
  ADDX #(.size(10)) inst232 (.A(px), .B(inst233_data), .Cin(1'b0), .F(inst232_f));  // open: Cout
  ADDX #(.size(10)) inst251 (.A(px), .B(inst254_data), .Cin(1'b0), .F(inst251_f));  // open: Cout
  ADDX #(.size(10)) inst255 (.A(px), .B(inst258_data), .Cin(1'b0), .F(inst255_f));  // open: Cout
  CMPX #(.size(10)) inst272 (.A(x), .B(inst271_f), .eq(inst272_eq));  // open: ls, gr
  CMPX #(.size(10)) inst164 (.A(inst166_f), .B(x), .eq(inst164_eq));  // open: ls, gr
  CMPX #(.size(10)) inst180 (.A(inst182_f), .B(x), .eq(inst180_eq));  // open: ls, gr
  CMPX #(.size(10)) inst205 (.A(inst206_f), .B(x), .eq(inst205_eq));  // open: ls, gr
  CMPX #(.size(10)) inst329 (.A(x), .B(inst328_f), .ls(inst329_ls));  // open: eq, gr
  CMPX #(.size(10)) inst234 (.A(x), .B(inst232_f), .eq(inst234_eq));  // open: ls, gr
  CMPX #(.size(10)) inst236 (.A(x), .B(inst235_f), .eq(inst236_eq));  // open: ls, gr
  ADDX #(.size(10)) inst238 (.A(px), .B(inst240_data), .Cin(1'b0), .F(inst238_f));  // open: Cout
  ADDX #(.size(10)) inst241 (.A(px), .B(inst243_data), .Cin(1'b0), .F(inst241_f));  // open: Cout
  CONSTX #(.size(10), .\const (2)) inst51 (.data(inst51_data));
  CONSTX #(.size(10), .\const (7)) inst146 (.data(inst146_data));
  CMPX #(.size(10)) inst256 (.A(x), .B(inst255_f), .ls(inst256_ls));  // open: eq, gr
  CMPX #(.size(10)) inst194 (.A(inst196_f), .B(x), .eq(inst194_eq));  // open: ls, gr
  CMPX #(.size(10)) inst208 (.A(inst210_f), .B(x), .eq(inst208_eq));  // open: ls, gr
  CONSTX #(.size(10), .\const (21)) inst283 (.data(inst283_data));
  CONSTX #(.size(10), .\const (9)) inst340 (.data(inst340_data));
  CONSTX #(.size(10), .\const (36)) inst341 (.data(inst341_data));
  CONSTX #(.size(10), .\const (10)) inst342 (.data(inst342_data));
  CONSTX #(.size(10), .\const (37)) inst343 (.data(inst343_data));
  CONSTX #(.size(10), .\const (11)) inst344 (.data(inst344_data));
  CONSTX #(.size(10), .\const (38)) inst345 (.data(inst345_data));
  CONSTX #(.size(10), .\const (31)) inst346 (.data(inst346_data));
  CONSTX #(.size(10), .\const (39)) inst347 (.data(inst347_data));
  CONSTX #(.size(10), .\const (34)) inst348 (.data(inst348_data));
  CONSTX #(.size(10), .\const (37)) inst349 (.data(inst349_data));
  ADDX #(.size(10)) inst68 (.A(px), .B(inst69_data), .Cin(1'b0), .F(inst68_f));  // open: Cout
  CMPX #(.size(10)) inst89 (.A(inst91_f), .B(x), .eq(inst89_eq));  // open: ls, gr
  CMPX #(.size(10)) inst239 (.A(x), .B(inst238_f), .eq(inst239_eq));  // open: ls, gr
  CMPX #(.size(10)) inst242 (.A(x), .B(inst241_f), .eq(inst242_eq));  // open: ls, gr
  CMPX #(.size(10)) inst252 (.A(x), .B(inst251_f), .ls(inst252_ls));  // open: eq, gr
  CONSTX #(.size(10), .\const (19)) inst170 (.data(inst170_data));
  CONSTX #(.size(10), .\const (35)) inst350 (.data(inst350_data));
  CONSTX #(.size(10), .\const (36)) inst351 (.data(inst351_data));
  ADDX #(.size(10)) inst79 (.A(px), .B(inst86_data), .Cin(1'b0), .F(inst79_f));  // open: Cout
  CONSTX #(.size(10), .\const (4)) inst1 (.data(inst1_data));
  CONSTX #(.size(10), .\const (4)) inst7 (.data(inst7_data));
  ADDX #(.size(10)) inst142 (.A(px), .B(inst146_data), .Cin(1'b0), .F(inst142_f));  // open: Cout
  not inst11 (inst11_out, inst252_ls);
  CONSTX #(.size(10), .\const (43)) inst149 (.data(inst149_data));
  not inst12 (inst12_out, inst256_ls);
  ADDX #(.size(10)) inst191 (.A(py), .B(inst283_data), .Cin(1'b0), .F(inst191_f));  // open: Cout
  CMPX #(.size(10)) inst66 (.A(x), .B(inst68_f), .ls(inst66_ls));  // open: eq, gr
  krug2 inst (.X(x), .Y(y), .xx(inst52_f), .yy(inst54_f), .r(inst1_data), .validUnutra(z10));  // open: validSpolja
  krug2 inst4 (.X(x), .Y(y), .xx(inst137_f), .yy(inst138_f), .r(inst7_data), .validUnutra(z[12]));  // open: validSpolja
  ADDX #(.size(10)) inst167 (.A(py), .B(inst170_data), .Cin(1'b0), .F(inst167_f));  // open: Cout
  tacka inst327fwrf214 (.x(x), .y(y), .px(px), .py(py), .constX(inst340_data), .constY(inst341_data), .valid(cr34));
  CMPX #(.size(10)) inst80 (.A(x), .B(inst79_f), .ls(inst80_ls));  // open: eq, gr
  ADDX #(.size(10)) inst47 (.A(px), .B(inst51_data), .Cin(1'b0), .F(inst47_f));  // open: Cout
  ADDX #(.size(10)) inst148 (.A(px), .B(inst149_data), .Cin(1'b0), .F(inst148_f));  // open: Cout
  CONSTX #(.size(10), .\const (21)) inst162 (.data(inst162_data));
  CONSTX #(.size(10), .\const (24)) inst321 (.data(inst321_data));
  and inst318 (cr24, inst314_ls, inst312_out, inst315_ls, inst317_out);
  tacka inst327sasafg (.x(x), .y(y), .px(px), .py(py), .constX(inst342_data), .constY(inst343_data), .valid(cr35));
  tacka inst327 (.x(x), .y(y), .px(px), .py(py), .constX(inst344_data), .constY(inst345_data), .valid(cr36));
  tacka inst327hteq (.x(x), .y(y), .px(px), .py(py), .constX(inst346_data), .constY(inst347_data), .valid(cr37));
  tacka inst327hrtw (.x(x), .y(y), .px(px), .py(py), .constX(inst348_data), .constY(inst349_data), .valid(cr38));
  tacka inst327ty346 (.x(x), .y(y), .px(px), .py(py), .constX(inst350_data), .constY(inst351_data), .valid(cr39));
  CMPX #(.size(10)) inst141 (.A(x), .B(inst142_f), .ls(inst141_ls));  // open: eq, gr
  and inst273 (cr5, inst272_eq, inst159_ls, inst161_out);
  CMPX #(.size(10)) inst189 (.A(inst191_f), .B(y), .eq(inst189_eq));  // open: ls, gr
  CONSTX #(.size(10), .\const (23)) inst336 (.data(inst336_data));
  and inst333 (cr25, inst329_ls, inst327i75tyj_out, inst330_ls, inst332_out);
  CONSTX #(.size(10), .\const (1)) inst99 (.data(inst99_data));
  and inst227 (z4, inst236_eq, inst95_ls, inst97_out);
  CMPX #(.size(10)) inst45 (.A(inst47_f), .B(x), .eq(inst45_eq));  // open: ls, gr
  CMPX #(.size(10)) inst165 (.A(inst167_f), .B(y), .eq(inst165_eq));  // open: ls, gr
  ADDX #(.size(10)) inst311 (.A(py), .B(inst321_data), .Cin(1'b0), .F(inst311_f));  // open: Cout
  or inst439 (valid, tamnozuta, zuta, crvena, roze, tamnocrvena, bela, plava, crna);
  and inst226 (z2, inst234_eq, inst95_ls, inst97_out);
  CONSTX #(.size(10), .\const (32)) inst113 (.data(inst113_data));
  and inst228 (z5, inst239_eq, inst110_ls, inst112_out);
  CONSTX #(.size(10), .\const (46)) inst120 (.data(inst120_data));
  CONSTX #(.size(10), .\const (33)) inst127 (.data(inst127_data));
  and inst230 (z7, inst242_eq, inst124_ls, inst126_out);
  and inst253 (cr0, inst141_ls, inst11_out, inst143_eq);
  CMPX #(.size(10)) inst145 (.A(x), .B(inst148_f), .ls(inst145_ls));  // open: eq, gr
  ADDX #(.size(10)) inst158 (.A(py), .B(inst162_data), .Cin(1'b0), .F(inst158_f));  // open: Cout
  ADDX #(.size(10)) inst92 (.A(py), .B(inst99_data), .Cin(1'b0), .F(inst92_f));  // open: Cout
  and inst229 (z6, inst239_eq, inst117_ls, inst119_out);
  CONSTX #(.size(10), .\const (47)) inst134 (.data(inst134_data));
  and inst231 (z8, inst242_eq, inst131_ls, inst133_out);
  CONSTX #(.size(10), .\const (48)) inst50 (.data(inst50_data));
  CONSTX #(.size(10), .\const (24)) inst58 (.data(inst58_data));
  CONSTX #(.size(10), .\const (46)) inst136 (.data(inst136_data));
  CONSTX #(.size(10), .\const (18)) inst147 (.data(inst147_data));
  and inst192 (cr16, inst189_eq, inst188_eq);
  and inst203 (cr17, inst189_eq, inst193_eq);
  not inst317 (inst317_out, inst309_ls);
  ADDX #(.size(10)) inst326 (.A(py), .B(inst336_data), .Cin(1'b0), .F(inst326_f));  // open: Cout
  CONSTX #(.size(10), .\const (0)) inst65 (.data(inst65_data));
  and inst73 (zuta, inst66_ls, inst63_out, inst67_ls, inst72_out);
  ADDX #(.size(10)) inst109 (.A(py), .B(inst113_data), .Cin(1'b0), .F(inst109_f));  // open: Cout
  ADDX #(.size(10)) inst123 (.A(py), .B(inst127_data), .Cin(1'b0), .F(inst123_f));  // open: Cout
  CMPX #(.size(10)) inst157 (.A(y), .B(inst158_f), .ls(inst157_ls));  // open: eq, gr
  not inst161 (inst161_out, inst157_ls);
  and inst168 (cr6, inst165_eq, inst164_eq);
  and inst184 (cr7, inst165_eq, inst180_eq);
  and inst207 (cr18, inst189_eq, inst205_eq);
  CMPX #(.size(10)) inst309 (.A(y), .B(inst311_f), .ls(inst309_ls));  // open: eq, gr
  CONSTX #(.size(10), .\const (0)) inst87 (.data(inst87_data));
  and inst84 (z0, inst80_ls, inst78_out, zz2, zz1);
  not inst97 (inst97_out, inst90_ls);
  ADDX #(.size(10)) inst116 (.A(py), .B(inst120_data), .Cin(1'b0), .F(inst116_f));  // open: Cout
  ADDX #(.size(10)) inst130 (.A(py), .B(inst134_data), .Cin(1'b0), .F(inst130_f));  // open: Cout
  ADDX #(.size(10)) inst48 (.A(py), .B(inst50_data), .Cin(1'b0), .F(inst48_f));  // open: Cout
  ADDX #(.size(10)) inst57 (.A(py), .B(inst136_data), .Cin(1'b0), .F(inst57_f));  // open: Cout
  ADDX #(.size(10)) inst144 (.A(py), .B(inst147_data), .Cin(1'b0), .F(inst144_f));  // open: Cout
  CONSTX #(.size(10), .\const (1)) inst178 (.data(inst178_data));
  CONSTX #(.size(10), .\const (4)) inst187 (.data(inst187_data));
  CONSTX #(.size(10), .\const (40)) inst201 (.data(inst201_data));
  and inst198 (cr8, inst165_eq, inst194_eq);
  CONSTX #(.size(10), .\const (44)) inst215 (.data(inst215_data));
  and inst212 (cr9, inst165_eq, inst208_eq);
  CMPX #(.size(10)) inst324 (.A(y), .B(inst326_f), .ls(inst324_ls));  // open: eq, gr
  not inst332 (inst332_out, inst324_ls);
  ADDX #(.size(10)) inst62 (.A(py), .B(inst65_data), .Cin(1'b0), .F(inst62_f));  // open: Cout
  and inst93 (z1, inst75_eq, inst89_eq);
  CMPX #(.size(10)) inst90 (.A(y), .B(inst92_f), .ls(inst90_ls));  // open: eq, gr
  not inst112 (inst112_out, inst108_ls);
  not inst126 (inst126_out, inst122_ls);
  ADDX #(.size(10)) inst56 (.A(px), .B(inst58_data), .Cin(1'b0), .F(inst56_f));  // open: Cout
  and inst257 (cr1, inst145_ls, inst12_out, inst143_eq);
  ADDX #(.size(10)) inst77 (.A(py), .B(inst87_data), .Cin(1'b0), .F(inst77_f));  // open: Cout
  CMPX #(.size(10)) inst108 (.A(y), .B(inst109_f), .ls(inst108_ls));  // open: eq, gr
  CMPX #(.size(10)) inst115 (.A(y), .B(inst116_f), .ls(inst115_ls));  // open: eq, gr
  not inst119 (inst119_out, inst115_ls);
  CMPX #(.size(10)) inst122 (.A(y), .B(inst123_f), .ls(inst122_ls));  // open: eq, gr
  not inst133 (inst133_out, inst129_ls);
  CONSTX #(.size(10), .\const (25)) inst163 (.data(inst163_data));
  CONSTX #(.size(10), .\const (26)) inst322 (.data(inst322_data));
  CONSTX #(.size(10), .\const (5)) inst353 (.data(inst353_data));
  CONSTX #(.size(10), .\const (9)) inst354 (.data(inst354_data));
  CONSTX #(.size(10), .\const (26)) inst355 (.data(inst355_data));
  not inst72 (inst72_out, inst60_ls);
  CONSTX #(.size(10), .\const (4)) inst100 (.data(inst100_data));
  CMPX #(.size(10)) inst129 (.A(y), .B(inst130_f), .ls(inst129_ls));  // open: eq, gr
  CMPX #(.size(10)) inst46 (.A(inst48_f), .B(y), .eq(inst46_eq));  // open: ls, gr
  CMPX #(.size(10)) inst143 (.A(y), .B(inst144_f), .eq(inst143_eq));  // open: ls, gr
  ADDX #(.size(10)) inst175 (.A(px), .B(inst178_data), .Cin(1'b0), .F(inst175_f));  // open: Cout
  ADDX #(.size(10)) inst183 (.A(px), .B(inst187_data), .Cin(1'b0), .F(inst183_f));  // open: Cout
  CONSTX #(.size(10), .\const (41)) inst279 (.data(inst279_data));
  CONSTX #(.size(10), .\const (25)) inst337 (.data(inst337_data));
  CONSTX #(.size(10), .\const (12)) inst357 (.data(inst357_data));
  CONSTX #(.size(10), .\const (14)) inst358 (.data(inst358_data));
  CONSTX #(.size(10), .\const (39)) inst359 (.data(inst359_data));
  CONSTX #(.size(10), .\const (14)) inst361 (.data(inst361_data));
  CONSTX #(.size(10), .\const (16)) inst362 (.data(inst362_data));
  CONSTX #(.size(10), .\const (40)) inst363 (.data(inst363_data));
  CONSTX #(.size(10), .\const (29)) inst365 (.data(inst365_data));
  CONSTX #(.size(10), .\const (31)) inst366 (.data(inst366_data));
  CONSTX #(.size(10), .\const (40)) inst367 (.data(inst367_data));
  CMPX #(.size(10)) inst60 (.A(y), .B(inst62_f), .ls(inst60_ls));  // open: eq, gr
  not inst83 (zz1, inst75_ls);
  CONSTX #(.size(10), .\const (36)) inst114 (.data(inst114_data));
  CONSTX #(.size(10), .\const (35)) inst128 (.data(inst128_data));
  ADDX #(.size(10)) inst160 (.A(py), .B(inst163_data), .Cin(1'b0), .F(inst160_f));  // open: Cout
  ADDX #(.size(10)) inst197 (.A(px), .B(inst201_data), .Cin(1'b0), .F(inst197_f));  // open: Cout
  ADDX #(.size(10)) inst211 (.A(px), .B(inst215_data), .Cin(1'b0), .F(inst211_f));  // open: Cout
  ADDX #(.size(10)) inst316 (.A(py), .B(inst322_data), .Cin(1'b0), .F(inst316_f));  // open: Cout
  CMPX #(.size(10)) inst75 (.A(y), .B(inst77_f), .ls(inst75_ls), .eq(inst75_eq));  // open: gr
  CONSTX #(.size(10), .\const (50)) inst121 (.data(inst121_data));
  CONSTX #(.size(10), .\const (50)) inst135 (.data(inst135_data));
  CONSTX #(.size(10), .\const (3)) inst3 (.data(inst3_data));
  CONSTX #(.size(10), .\const (1)) inst293 (.data(inst293_data));
  CONSTX #(.size(10), .\const (3)) inst295 (.data(inst295_data));
  CONSTX #(.size(10), .\const (43)) inst296 (.data(inst296_data));
  ADDX #(.size(10)) inst331 (.A(py), .B(inst337_data), .Cin(1'b0), .F(inst331_f));  // open: Cout
  ADDX #(.size(10)) inst96 (.A(py), .B(inst100_data), .Cin(1'b0), .F(inst96_f));  // open: Cout
  ADDX #(.size(10)) inst111 (.A(py), .B(inst114_data), .Cin(1'b0), .F(inst111_f));  // open: Cout
  ADDX #(.size(10)) inst125 (.A(py), .B(inst128_data), .Cin(1'b0), .F(inst125_f));  // open: Cout
  and inst49 (z9, inst46_eq, inst45_eq);
  krug2 inst2 (.X(x), .Y(y), .xx(inst56_f), .yy(inst57_f), .r(inst3_data), .validUnutra(z11));  // open: validSpolja
  CONSTX #(.size(10), .\const (44)) inst270 (.data(inst270_data));
  CMPX #(.size(10)) inst172 (.A(inst175_f), .B(x), .eq(inst172_eq));  // open: ls, gr
  CMPX #(.size(10)) inst181 (.A(inst183_f), .B(x), .eq(inst181_eq));  // open: ls, gr
  CMPX #(.size(10)) inst195 (.A(inst197_f), .B(x), .eq(inst195_eq));  // open: ls, gr
  CMPX #(.size(10)) inst209 (.A(inst211_f), .B(x), .eq(inst209_eq));  // open: ls, gr
  ADDX #(.size(10)) inst276 (.A(px), .B(inst279_data), .Cin(1'b0), .F(inst276_f));  // open: Cout
  CONSTX #(.size(10), .\const (50)) inst71 (.data(inst71_data));
  CONSTX #(.size(10), .\const (5)) inst88 (.data(inst88_data));
  CONSTX #(.size(10), .\const (43)) inst105 (.data(inst105_data));
  ADDX #(.size(10)) inst118 (.A(py), .B(inst121_data), .Cin(1'b0), .F(inst118_f));  // open: Cout
  ADDX #(.size(10)) inst132 (.A(py), .B(inst135_data), .Cin(1'b0), .F(inst132_f));  // open: Cout
  CMPX #(.size(10)) inst159 (.A(y), .B(inst160_f), .ls(inst159_ls));  // open: eq, gr
  CONSTX #(.size(10), .\const (24)) inst218 (.data(inst218_data));
  CMPX #(.size(10)) inst315 (.A(y), .B(inst316_f), .ls(inst315_ls));  // open: eq, gr
  duzHoriz inst352 (
    .x(x), .y(y), .px(px), .py(py), .constX1(inst353_data), .constX2(inst354_data), .constY(inst355_data),
    .valid(cr40));
  duzHoriz inst356 (
    .x(x), .y(y), .px(px), .py(py), .constX1(inst357_data), .constX2(inst358_data), .constY(inst359_data),
    .valid(cr41));
  duzHoriz inst360 (
    .x(x), .y(y), .px(px), .py(py), .constX1(inst361_data), .constX2(inst362_data), .constY(inst363_data),
    .valid(cr42));
  duzHoriz inst364 (
    .x(x), .y(y), .px(px), .py(py), .constX1(inst365_data), .constX2(inst366_data), .constY(inst367_data),
    .valid(cr43));
  CMPX #(.size(10)) inst95 (.A(y), .B(inst96_f), .ls(inst95_ls));  // open: eq, gr
  CONSTX #(.size(10), .\const (8)) inst262 (.data(inst262_data));
  CONSTX #(.size(10), .\const (36)) inst266 (.data(inst266_data));
  CONSTX #(.size(10), .\const (20)) inst179 (.data(inst179_data));
  ADDX #(.size(10)) inst281 (.A(px), .B(inst293_data), .Cin(1'b0), .F(inst281_f));  // open: Cout
  ADDX #(.size(10)) inst288 (.A(px), .B(inst295_data), .Cin(1'b0), .F(inst288_f));  // open: Cout
  ADDX #(.size(10)) inst291 (.A(px), .B(inst296_data), .Cin(1'b0), .F(inst291_f));  // open: Cout
  CMPX #(.size(10)) inst330 (.A(y), .B(inst331_f), .ls(inst330_ls));  // open: eq, gr
  MP2X #(.size(12)) inst246 (.S(tamnozuta), .X0(12'b111111100011), .X1(12'b111110110001), .Y(inst246_y));
  ADDX #(.size(10)) inst70 (.A(py), .B(inst71_data), .Cin(1'b0), .F(inst70_f));  // open: Cout
  ADDX #(.size(10)) inst82 (.A(py), .B(inst88_data), .Cin(1'b0), .F(inst82_f));  // open: Cout
  CMPX #(.size(10)) inst110 (.A(y), .B(inst111_f), .ls(inst110_ls));  // open: eq, gr
  CMPX #(.size(10)) inst124 (.A(y), .B(inst125_f), .ls(inst124_ls));  // open: eq, gr
  CMPX #(.size(10)) inst275 (.A(inst276_f), .B(x), .eq(inst275_eq));  // open: ls, gr
  ADDX #(.size(10)) inst101 (.A(px), .B(inst105_data), .Cin(1'b0), .F(inst101_f));  // open: Cout
  CMPX #(.size(10)) inst117 (.A(y), .B(inst118_f), .ls(inst117_ls));  // open: eq, gr
  CMPX #(.size(10)) inst131 (.A(y), .B(inst132_f), .ls(inst131_ls));  // open: eq, gr
  ADDX #(.size(10)) inst268 (.A(px), .B(inst270_data), .Cin(1'b0), .F(inst268_f));  // open: Cout
  ADDX #(.size(10)) inst176 (.A(py), .B(inst179_data), .Cin(1'b0), .F(inst176_f));  // open: Cout
  ADDX #(.size(10)) inst217 (.A(py), .B(inst218_data), .Cin(1'b0), .F(inst217_f));  // open: Cout
  CMPX #(.size(10)) inst67 (.A(y), .B(inst70_f), .ls(inst67_ls));  // open: eq, gr
  ADDX #(.size(10)) inst259 (.A(px), .B(inst262_data), .Cin(1'b0), .F(inst259_f));  // open: Cout
  CMPX #(.size(10)) inst278 (.A(inst281_f), .B(x), .eq(inst278_eq));  // open: ls, gr
  CMPX #(.size(10)) inst287 (.A(inst288_f), .B(x), .eq(inst287_eq));  // open: ls, gr
  CMPX #(.size(10)) inst290 (.A(inst291_f), .B(x), .eq(inst290_eq));  // open: ls, gr
  MP2X #(.size(12)) inst244 (.S(bela), .X0(nast), .X1({12{1'b1}}), .Y(inst244_y));
  CMPX #(.size(10)) inst81 (.A(y), .B(inst82_f), .ls(zz2));  // open: eq, gr
  ADDX #(.size(10)) inst264 (.A(px), .B(inst266_data), .Cin(1'b0), .F(inst264_f));  // open: Cout
  CMPX #(.size(10)) inst269 (.A(x), .B(inst268_f), .eq(inst269_eq));  // open: ls, gr
  CONSTX #(.size(10), .\const (25)) inst294 (.data(inst294_data));
  MP2X #(.size(12)) inst248 (.S(tamnocrvena), .X0(inst246_y), .X1(12'b011100010001), .Y(inst248_y));
  CONSTX #(.size(10), .\const (45)) inst106 (.data(inst106_data));
  CMPX #(.size(10)) inst98 (.A(x), .B(inst101_f), .ls(inst98_ls));  // open: eq, gr
  not inst102 (inst102_out, inst98_ls);
  CMPX #(.size(10)) inst260 (.A(x), .B(inst259_f), .eq(inst260_eq));  // open: ls, gr
  CMPX #(.size(10)) inst265 (.A(x), .B(inst264_f), .eq(inst265_eq));  // open: ls, gr
  CMPX #(.size(10)) inst174 (.A(inst176_f), .B(y), .eq(inst174_eq));  // open: ls, gr
  CMPX #(.size(10)) inst216 (.A(inst217_f), .B(y), .eq(inst216_eq));  // open: ls, gr
  CONSTX #(.size(10), .\const (32)) inst369 (.data(inst369_data));
  CONSTX #(.size(10), .\const (34)) inst370 (.data(inst370_data));
  CONSTX #(.size(10), .\const (38)) inst371 (.data(inst371_data));
  CONSTX #(.size(10), .\const (16)) inst373 (.data(inst373_data));
  CONSTX #(.size(10), .\const (29)) inst374 (.data(inst374_data));
  CONSTX #(.size(10), .\const (41)) inst375 (.data(inst375_data));
  CONSTX #(.size(10), .\const (37)) inst377 (.data(inst377_data));
  CONSTX #(.size(10), .\const (40)) inst378 (.data(inst378_data));
  CONSTX #(.size(10), .\const (25)) inst379 (.data(inst379_data));
  ADDX #(.size(10)) inst285 (.A(py), .B(inst294_data), .Cin(1'b0), .F(inst285_f));  // open: Cout
  CONSTX #(.size(10), .\const (35)) inst381 (.data(inst381_data));
  CONSTX #(.size(10), .\const (37)) inst382 (.data(inst382_data));
  CONSTX #(.size(10), .\const (26)) inst383 (.data(inst383_data));
  and inst277 (cr15, inst216_eq, inst275_eq);
  MP2X #(.size(12)) inst250 (.S(roze), .X0(inst248_y), .X1(12'b111101111010), .Y(inst250_y));
  MP2X #(.size(12)) inst249 (.S(crvena), .X0(inst244_y), .X1(12'b101100100010), .Y(inst249_y));
  and inst177 (cr10, inst174_eq, inst172_eq);
  and inst186 (cr11, inst174_eq, inst181_eq);
  and inst200 (cr12, inst174_eq, inst195_eq);
  CONSTX #(.size(10), .\const (5)) inst223 (.data(inst223_data));
  and inst214 (cr13, inst216_eq, inst209_eq);
  ADDX #(.size(10)) inst103 (.A(px), .B(inst106_data), .Cin(1'b0), .F(inst103_f));  // open: Cout
  CMPX #(.size(10)) inst280 (.A(inst285_f), .B(y), .eq(inst280_eq));  // open: ls, gr
  duzHoriz inst368 (
    .x(x), .y(y), .px(px), .py(py), .constX1(inst369_data), .constX2(inst370_data), .constY(inst371_data),
    .valid(cr44));
  duzHoriz inst372 (
    .x(x), .y(y), .px(px), .py(py), .constX1(inst373_data), .constX2(inst374_data), .constY(inst375_data),
    .valid(cr45));
  CMPX #(.size(10)) inst104 (.A(x), .B(inst103_f), .ls(inst104_ls));  // open: eq, gr
  and inst267 (cr4, inst269_eq, inst152_ls, inst154_out);
  duzHoriz inst376 (
    .x(x), .y(y), .px(px), .py(py), .constX1(inst377_data), .constX2(inst378_data), .constY(inst379_data),
    .valid(cr46));
  duzHoriz inst380 (
    .x(x), .y(y), .px(px), .py(py), .constX1(inst381_data), .constX2(inst382_data), .constY(inst383_data),
    .valid(cr47));
  MP2X #(.size(12)) inst247 (.S(plava), .X0(inst249_y), .X1(12'b000110101110), .Y(RGB));
  CONSTX #(.size(10), .\const (20)) inst155 (.data(inst155_data));
  and inst261 (cr2, inst260_eq, inst152_ls, inst154_out);
  ADDX #(.size(10)) inst220 (.A(px), .B(inst223_data), .Cin(1'b0), .F(inst220_f));  // open: Cout
  MP2X #(.size(12)) inst245 (.S(crna), .X0(inst250_y), .X1({12{1'b0}}), .Y(nast));
  and inst263 (cr3, inst265_eq, inst152_ls, inst154_out);
  ADDX #(.size(10)) inst151 (.A(py), .B(inst155_data), .Cin(1'b0), .F(inst151_f));  // open: Cout
  and inst286 (cr19, inst280_eq, inst278_eq);
  and inst289 (cr20, inst280_eq, inst287_eq);
  and inst292 (cr21, inst280_eq, inst290_eq);
  CONSTX #(.size(10), .\const (23)) inst224 (.data(inst224_data));
  CMPX #(.size(10)) inst219 (.A(inst220_f), .B(x), .eq(inst219_eq));  // open: ls, gr
  CONSTX #(.size(10), .\const (4)) inst305 (.data(inst305_data));
  CONSTX #(.size(10), .\const (39)) inst307 (.data(inst307_data));
  CONSTX #(.size(10), .\const (16)) inst413 (.data(inst413_data));
  CONSTX #(.size(10), .\const (29)) inst414 (.data(inst414_data));
  CONSTX #(.size(10), .\const (38)) inst415 (.data(inst415_data));
  CONSTX #(.size(10), .\const (41)) inst416 (.data(inst416_data));
  CONSTX #(.size(10), .\const (16)) inst418 (.data(inst418_data));
  CONSTX #(.size(10), .\const (21)) inst419 (.data(inst419_data));
  CONSTX #(.size(10), .\const (37)) inst420 (.data(inst420_data));
  CONSTX #(.size(10), .\const (24)) inst422 (.data(inst422_data));
  CONSTX #(.size(10), .\const (29)) inst423 (.data(inst423_data));
  not inst154 (inst154_out, inst150_ls);
  and inst107 (z3, inst104_ls, inst102_out, zz1, zz2);
  CMPX #(.size(10)) inst150 (.A(y), .B(inst151_f), .ls(inst150_ls));  // open: eq, gr
  CONSTX #(.size(10), .\const (9)) inst385 (.data(inst385_data));
  CONSTX #(.size(10), .\const (12)) inst386 (.data(inst386_data));
  CONSTX #(.size(10), .\const (27)) inst387 (.data(inst387_data));
  ADDX #(.size(10)) inst299 (.A(px), .B(inst305_data), .Cin(1'b0), .F(inst299_f));  // open: Cout
  ADDX #(.size(10)) inst302 (.A(px), .B(inst307_data), .Cin(1'b0), .F(inst302_f));  // open: Cout
  CONSTX #(.size(10), .\const (33)) inst389 (.data(inst389_data));
  CONSTX #(.size(10), .\const (35)) inst390 (.data(inst390_data));
  CONSTX #(.size(10), .\const (12)) inst393 (.data(inst393_data));
  CONSTX #(.size(10), .\const (15)) inst394 (.data(inst394_data));
  CONSTX #(.size(10), .\const (28)) inst395 (.data(inst395_data));
  CONSTX #(.size(10), .\const (30)) inst397 (.data(inst397_data));
  CONSTX #(.size(10), .\const (33)) inst398 (.data(inst398_data));
  CONSTX #(.size(10), .\const (25)) inst156 (.data(inst156_data));
  ADDX #(.size(10)) inst222 (.A(py), .B(inst224_data), .Cin(1'b0), .F(inst222_f));  // open: Cout
  kvadrat inst412 (
    .x(x), .y(y), .px(px), .py(py), .constX1(inst413_data), .constX2(inst414_data), .constY1(inst415_data),
    .constY2(inst416_data), .valid(r0));
  duzHoriz inst417 (
    .x(x), .y(y), .px(px), .py(py), .constX1(inst418_data), .constX2(inst419_data), .constY(inst420_data),
    .valid(r1));
  duzHoriz inst421 (
    .x(x), .y(y), .px(px), .py(py), .constX1(inst422_data), .constX2(inst423_data), .constY(inst420_data),
    .valid(r2));
  ADDX #(.size(10)) inst153 (.A(py), .B(inst156_data), .Cin(1'b0), .F(inst153_f));  // open: Cout
  CMPX #(.size(10)) inst221 (.A(inst222_f), .B(y), .eq(inst221_eq));  // open: ls, gr
  CMPX #(.size(10)) inst297 (.A(inst299_f), .B(x), .eq(inst297_eq));  // open: ls, gr
  CMPX #(.size(10)) inst301 (.A(inst302_f), .B(x), .eq(inst301_eq));  // open: ls, gr
  duzHoriz inst384 (
    .x(x), .y(y), .px(px), .py(py), .constX1(inst385_data), .constX2(inst386_data), .constY(inst387_data),
    .valid(cr48));
  duzHoriz inst388 (
    .x(x), .y(y), .px(px), .py(py), .constX1(inst389_data), .constX2(inst390_data), .constY(inst387_data),
    .valid(cr49));
  duzHoriz inst392 (
    .x(x), .y(y), .px(px), .py(py), .constX1(inst393_data), .constX2(inst394_data), .constY(inst395_data),
    .valid(cr50));
  duzHoriz inst396 (
    .x(x), .y(y), .px(px), .py(py), .constX1(inst397_data), .constX2(inst398_data), .constY(inst395_data),
    .valid(cr51));
  CONSTX #(.size(10), .\const (22)) inst304 (.data(inst304_data));
  CMPX #(.size(10)) inst152 (.A(y), .B(inst153_f), .ls(inst152_ls));  // open: eq, gr
  and inst225 (cr14, inst221_eq, inst219_eq);
  ADDX #(.size(10)) inst306 (.A(py), .B(inst304_data), .Cin(1'b0), .F(inst306_f));  // open: Cout
  CONSTX #(.size(10), .\const (16)) inst490 (.data(inst490_data));
  CONSTX #(.size(10), .\const (21)) inst491 (.data(inst491_data));
  CONSTX #(.size(10), .\const (30)) inst489 (.data(inst489_data));
  CONSTX #(.size(10), .\const (34)) inst492 (.data(inst492_data));
  CONSTX #(.size(10), .\const (24)) inst495 (.data(inst495_data));
  CONSTX #(.size(10), .\const (29)) inst496 (.data(inst496_data));
  CMPX #(.size(10)) inst298 (.A(inst306_f), .B(y), .eq(inst298_eq));  // open: ls, gr
  CONSTX #(.size(10), .\const (13)) inst494 (.data(inst494_data));
  CONSTX #(.size(10), .\const (18)) inst497 (.data(inst497_data));
  CONSTX #(.size(10), .\const (11)) inst500 (.data(inst500_data));
  CONSTX #(.size(10), .\const (27)) inst501 (.data(inst501_data));
  CONSTX #(.size(10), .\const (32)) inst502 (.data(inst502_data));
  CONSTX #(.size(10), .\const (15)) inst432 (.data(inst432_data));
  CONSTX #(.size(10), .\const (38)) inst433 (.data(inst433_data));
  CONSTX #(.size(10), .\const (14)) inst426 (.data(inst426_data));
  CONSTX #(.size(10), .\const (16)) inst427 (.data(inst427_data));
  CONSTX #(.size(10), .\const (39)) inst428 (.data(inst428_data));
  CONSTX #(.size(10), .\const (29)) inst430 (.data(inst430_data));
  CONSTX #(.size(10), .\const (31)) inst431 (.data(inst431_data));
  CONSTX #(.size(10), .\const (16)) inst440 (.data(inst440_data));
  CONSTX #(.size(10), .\const (29)) inst441 (.data(inst441_data));
  CONSTX #(.size(10), .\const (31)) inst442 (.data(inst442_data));
  CONSTX #(.size(10), .\const (41)) inst443 (.data(inst443_data));
  CONSTX #(.size(10), .\const (29)) inst445 (.data(inst445_data));
  CONSTX #(.size(10), .\const (36)) inst446 (.data(inst446_data));
  CONSTX #(.size(10), .\const (29)) inst448 (.data(inst448_data));
  CONSTX #(.size(10), .\const (37)) inst447 (.data(inst447_data));
  CONSTX #(.size(10), .\const (9)) inst450 (.data(inst450_data));
  CONSTX #(.size(10), .\const (16)) inst451 (.data(inst451_data));
  CONSTX #(.size(10), .\const (15)) inst401 (.data(inst401_data));
  CONSTX #(.size(10), .\const (19)) inst402 (.data(inst402_data));
  CONSTX #(.size(10), .\const (29)) inst403 (.data(inst403_data));
  CONSTX #(.size(10), .\const (25)) inst405 (.data(inst405_data));
  CONSTX #(.size(10), .\const (30)) inst406 (.data(inst406_data));
  CONSTX #(.size(10), .\const (19)) inst409 (.data(inst409_data));
  CONSTX #(.size(10), .\const (25)) inst410 (.data(inst410_data));
  CONSTX #(.size(10), .\const (30)) inst411 (.data(inst411_data));
  CONSTX #(.size(10), .\const (11)) inst453 (.data(inst453_data));
  CONSTX #(.size(10), .\const (16)) inst454 (.data(inst454_data));
  CONSTX #(.size(10), .\const (37)) inst455 (.data(inst455_data));
  CONSTX #(.size(10), .\const (39)) inst456 (.data(inst456_data));
  CONSTX #(.size(10), .\const (6)) inst458 (.data(inst458_data));
  CONSTX #(.size(10), .\const (12)) inst459 (.data(inst459_data));
  CONSTX #(.size(10), .\const (27)) inst460 (.data(inst460_data));
  CONSTX #(.size(10), .\const (29)) inst461 (.data(inst461_data));
  CONSTX #(.size(10), .\const (7)) inst463 (.data(inst463_data));
  CONSTX #(.size(10), .\const (9)) inst464 (.data(inst464_data));
  CONSTX #(.size(10), .\const (29)) inst465 (.data(inst465_data));
  CONSTX #(.size(10), .\const (34)) inst466 (.data(inst466_data));
  kvadrat inst488 (
    .x(x), .y(y), .px(px), .py(py), .constX1(inst490_data), .constX2(inst491_data), .constY1(inst489_data),
    .constY2(inst492_data), .valid(b0));
  kvadrat inst493 (
    .x(x), .y(y), .px(px), .py(py), .constX1(inst495_data), .constX2(inst496_data), .constY1(inst489_data),
    .constY2(inst492_data), .valid(b1));
  and inst300 (cr22, inst298_eq, inst297_eq);
  and inst303 (cr23, inst298_eq, inst301_eq);
  duzHoriz inst400 (
    .x(x), .y(y), .px(px), .py(py), .constX1(inst401_data), .constX2(inst402_data), .constY(inst403_data),
    .valid(cr52));
  duzHoriz inst404 (
    .x(x), .y(y), .px(px), .py(py), .constX1(inst405_data), .constX2(inst406_data), .constY(inst403_data),
    .valid(cr53));
  duzHoriz inst8 (
    .x(x), .y(y), .px(px), .py(py), .constX1(inst494_data), .constX2(inst497_data), .constY(inst500_data),
    .valid(p0));
  duzHoriz inst9 (
    .x(x), .y(y), .px(px), .py(py), .constX1(inst501_data), .constX2(inst502_data), .constY(inst500_data),
    .valid(p1));
  tacka inst424 (.x(x), .y(y), .px(px), .py(py), .constX(inst432_data), .constY(inst433_data), .valid(r5));
  duzHoriz inst425 (
    .x(x), .y(y), .px(px), .py(py), .constX1(inst426_data), .constX2(inst427_data), .constY(inst428_data),
    .valid(r3));
